# EAGLE schematic pdp8i-cpu (EAGLE 6.6.0), part 3 of 3
## Sheet 27 of 40
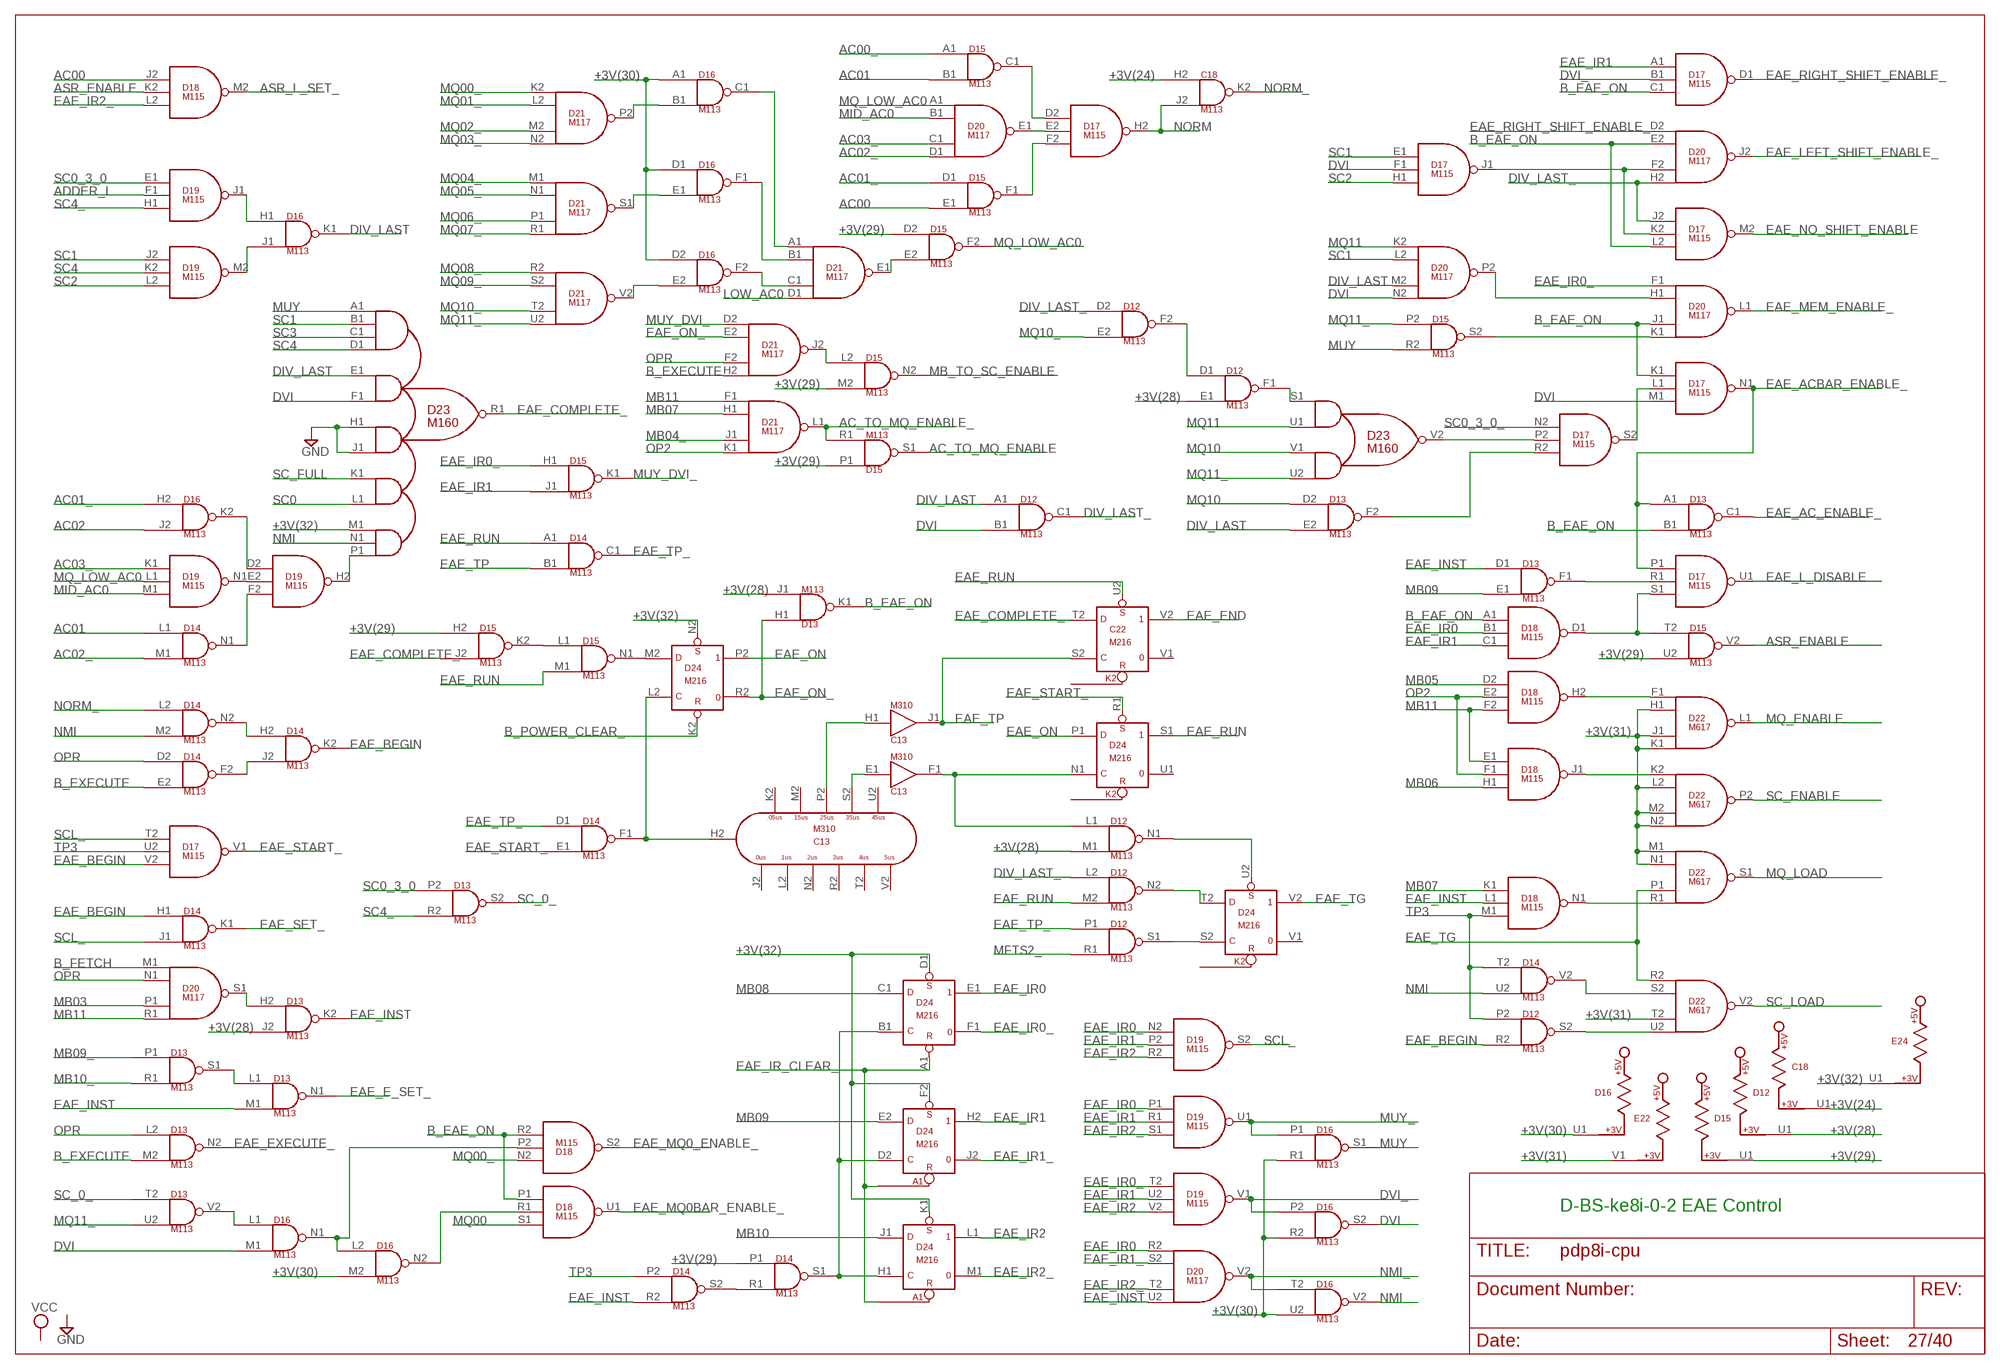
[diagram p27: schematic, sheet 27]

### Parts
C13  M310  [H807]
C18  M113  [H807]
C22  M216  [H807]
D12  M113  [H807]
D13  M113  [H807]
D14  M113  [H807]
D15  M113  [H807]
D16  M113  [H807]
D17  M115  [H807]
D18  M115  [H807]
D19  M115  [H807]
D20  M117  [H807]
D21  M117  [H807]
D22  M617  [H807]
D23  M160  [H807]
D24  M216  [H807]

### Nets
+3V(24): C18.H2(K2:IN1) C18.U1 ; also sheet 28
+3V(28): D12.E1(F1:IN2) D12.M1(N1:IN2) D12.U1 D13.J1(K1:IN2) D13.J2(K2:IN2) ; also sheet 28
+3V(29): D14.P1(S1:IN1) D15.D2(F2:IN1) D15.H2(K2:IN1) D15.M2(N2:IN2) D15.P1(S1:IN1) D15.U1 D15.U2(V2:IN2)
+3V(30): D16.A1(C1:IN1) D16.D1(F1:IN1) D16.D2(F2:IN1) D16.M2(N2:IN2) D16.R1(S1:IN2) D16.R2(S2:IN2) D16.U1 D16.U2(V2:IN2)
+3V(31): D22.H1(L1:IN2) D22.J1(L1:IN3) D22.K1(L1:IN4) D22.L2(P2:IN2) D22.M1(S1:IN1) D22.M2(P2:IN3) D22.N1(S1:IN2) D22.N2(P2:IN4) D22.T2(V2:IN3) E22.V1
+3V(32): D23.M1(R1:IN5A) D24.D1(E1:S) D24.F2(H2:S) D24.K1(L1:S) D24.N2(P2:S) E24.U1 ; also sheet 28
AC00: D15.E1(F1:IN2) D18.J2(M2:IN1) ; also sheet 7,9,14,28
AC00_: D15.A1(C1:IN1) ; also sheet 7,9
AC01: D14.L1(N1:IN1) D15.B1(C1:IN2) ; also sheet 9,14,28
AC01_: D15.D1(F1:IN1) D16.H2(K2:IN1) ; also sheet 7,9
AC02: D16.J2(K2:IN2) ; also sheet 9,14,28
AC02_: D14.M1(N1:IN2) D20.D1(E1:IN4) ; also sheet 7,9
AC03_: D19.K1(N1:IN1) D20.C1(E1:IN3) ; also sheet 7,9
AC_TO_MQ_ENABLE: D15.S1(S1:OUT) ; also sheet 28
AC_TO_MQ_ENABLE_: D15.R1(S1:IN2) D21.L1(L1:OUT) ; also sheet 5
ADDER_L: D19.F1(J1:IN2) ; also sheet 28
ASR_ENABLE: D15.V2(V2:OUT) D18.K2(M2:IN2) ; also sheet 9
ASR_L_SET_: D18.M2(M2:OUT) ; also sheet 9
B_EAE_ON: D13.B1(C1:IN2) D13.K1(K1:OUT) D17.C1(D1:IN3) D17.K1(N1:IN1) D17.L2(M2:IN3) D18.A1(D1:IN1) D18.P1(U1:IN1) D18.R2(S2:IN3) D20.E2(J2:IN2) D20.J1(L1:IN3) ; also sheet 9,28
B_EXECUTE: D13.M2(N2:IN2) D14.E2(F2:IN2) D21.H2(J2:IN4) ; also sheet 4,5,6,7
B_FETCH: D20.M1(S1:IN1) ; also sheet 2,4,5,6,7,8,22,29
B_POWER_CLEAR_: D24.K2(P2:R) ; also sheet 2,17
DIV_LAST: D12.A1(C1:IN1) D13.E2(F2:IN2) D16.K1(K1:OUT) D20.M2(P2:IN3) D23.E1(R1:IN2A)
DIV_LAST_: D12.C1(C1:OUT) D12.D2(F2:IN1) D12.L2(N2:IN1) D17.J2(M2:IN1) D20.H2(J2:IN4)
DVI: D12.B1(C1:IN2) D16.M1(N1:IN2) D16.S2(S2:OUT) D17.F1(J1:IN2) D17.M1(N1:IN3) D20.N2(P2:IN4) D23.F1(R1:IN2B)
DVI_: D16.P2(S2:IN1) D17.B1(D1:IN2) D19.V1(V1:OUT) ; also sheet 28
EAE_AC_ENABLE_: D13.C1(C1:OUT) ; also sheet 5
EAE_ACBAR_ENABLE_: D13.A1(C1:IN1) D17.N1(N1:OUT) D17.P1(U1:IN1) ; also sheet 5
EAE_BEGIN: D12.R2(S2:IN2) D14.H1(K1:IN1) D14.K2(K2:OUT) D17.V2(V1:IN3)
EAE_COMPLETE_: C22.T2(V2:D) D15.J2(K2:IN2) D23.R1(R1:OUT)
EAE_E_SET_: D13.N1(N1:OUT) ; also sheet 4,5
EAE_END: C22.V2 ; also sheet 2
EAE_EXECUTE_: D13.N2(N2:OUT) ; also sheet 6
EAE_INST: D13.D1(F1:IN1) D13.K2(K2:OUT) D13.M1(N1:IN2) D14.R2(S2:IN2) D18.L1(N1:IN2) D20.U2(V2:IN4)
EAE_IR0: D18.B1(D1:IN2) D20.R2(V2:IN1) D24.E1
EAE_IR0_: D15.H1(K1:IN1) D19.N2(S2:IN1) D19.P1(U1:IN1) D19.T2(V1:IN1) D20.F1(L1:IN1) D24.F1
EAE_IR1: D15.J1(K1:IN2) D17.A1(D1:IN1) D18.C1(D1:IN3) D19.R1(U1:IN2) D19.U2(V1:IN2) D24.H2
EAE_IR1_: D19.P2(S2:IN2) D20.S2(V2:IN2) D24.J2
EAE_IR2: D19.R2(S2:IN3) D19.V2(V1:IN3) D24.L1
EAE_IR2_: D18.L2(M2:IN3) D19.S1(U1:IN3) D20.T2(V2:IN3) D24.M1 ; also sheet 9
EAE_IR_CLEAR_: D24.A1(E1:R) ; also sheet 4
EAE_L_DISABLE: D17.U1(U1:OUT) ; also sheet 5
EAE_LEFT_SHIFT_ENABLE_: D20.J2(J2:OUT) ; also sheet 6
EAE_MEM_ENABLE_: D20.L1(L1:OUT) ; also sheet 5
EAE_MQ0_ENABLE_: D18.S2(S2:OUT) ; also sheet 13
EAE_MQ0BAR_ENABLE_: D18.U1(U1:OUT) ; also sheet 13
EAE_NO_SHIFT_ENABLE: D17.M2(M2:OUT) ; also sheet 6
EAE_ON: D24.P1(S1:D) D24.P2 ; also sheet 28
EAE_ON_: D13.H1(K1:IN1) D21.E2(J2:IN2) D24.R2 ; also sheet 9,13
EAE_RIGHT_SHIFT_ENABLE_: D17.D1(D1:OUT) D20.D2(J2:IN1) ; also sheet 6,28
EAE_RUN: C22.U2(V2:S) D12.M2(N2:IN2) D14.A1(C1:IN1) D15.M1(N1:IN2) D24.S1
EAE_SET_: D14.K1(K1:OUT) ; also sheet 2
EAE_START_: D14.E1(F1:IN2) D17.V1(V1:OUT) D24.R1(S1:S) ; also sheet 2
EAE_TG: D22.P1(S1:IN3) D22.R2(V2:IN1) D24.V2
EAE_TP: C13.J1(J1:OUT) C22.S2(V2:C) D14.B1(C1:IN2)
EAE_TP_: D12.P1(S1:IN1) D14.C1(C1:OUT) D14.D1(F1:IN1) ; also sheet 7,28
GND [Suppply]: D23.H1(R1:IN3A) D23.J1(R1:IN3B) ; also sheet 2,5,9,10,11,12,13,14,22,26,30
LOW_AC0: D21.D1(E1:IN4) ; also sheet 7
MB03: D20.P1(S1:IN3) ; also sheet 4,5,9,14,21,29,30
MB04_: D21.J1(L1:IN3) ; also sheet 5,8,9,14,29,30,32
MB05: D18.D2(H2:IN1) ; also sheet 5,7,9,14,21,30,32
MB06: D18.H1(J1:IN3) ; also sheet 5,7,9,14,21,22,30
MB07: D18.K1(N1:IN1) D21.H1(L1:IN2) ; also sheet 5,7,9,14,21,22,26,30
MB08: D24.C1(E1:D) ; also sheet 6,7,9,14,21,22,26,30
MB09: D13.E1(F1:IN2) D24.E2(H2:D) ; also sheet 2,5,6,9,14,21,22,29,30
MB09_: D13.P1(S1:IN1) ; also sheet 6,9,26,28,30
MB10: D24.J1(L1:D) ; also sheet 2,6,8,9,14,21,22,29,30
MB10_: D13.R1(S1:IN2) ; also sheet 6,8,9,22,26,28,30
MB11: D18.E1(J1:IN1) D18.F2(H2:IN3) D20.R1(S1:IN4) D21.F1(L1:IN1) ; also sheet 2,6,9,14,21,22,29,30
MB_TO_SC_ENABLE: D15.N2(N2:OUT) ; also sheet 28
MFTS2_: D12.R1(S1:IN2) ; also sheet 2
MID_AC0: D19.M1(N1:IN3) D20.B1(E1:IN2) ; also sheet 7
MQ00: D18.S1(U1:IN3) ; also sheet 10,28
MQ00_: D18.N2(S2:IN1) D21.K2(P2:IN1) ; also sheet 28
MQ01_: D21.L2(P2:IN2) ; also sheet 28
MQ02_: D21.M2(P2:IN3) ; also sheet 28
MQ03_: D21.N2(P2:IN4) ; also sheet 28
MQ04_: D21.M1(S1:IN1) ; also sheet 28
MQ05_: D21.N1(S1:IN2) ; also sheet 28
MQ06_: D21.P1(S1:IN3) ; also sheet 28
MQ07_: D21.R1(S1:IN4) ; also sheet 28
MQ08_: D21.R2(V2:IN1) ; also sheet 28
MQ09_: D21.S2(V2:IN2) ; also sheet 28
MQ10: D13.D2(F2:IN1) D23.V1(V2:IN2A) ; also sheet 13,28
MQ10_: D12.E2(F2:IN2) D21.T2(V2:IN3) ; also sheet 28
MQ11: D20.K2(P2:IN1) D23.U1(V2:IN1B) ; also sheet 13,28
MQ11_: D13.U2(V2:IN2) D15.P2(S2:IN1) D21.U2(V2:IN4) D23.U2(V2:IN2B) ; also sheet 28
MQ_ENABLE: D22.L1(L1:OUT) ; also sheet 10,11,12,13
MQ_LOAD: D22.S1(S1:OUT) ; also sheet 28
MQ_LOW_AC0: D15.F2(F2:OUT) D19.L1(N1:IN2) D20.A1(E1:IN1)
MUY: D15.R2(S2:IN2) D16.S1(S1:OUT) D23.A1(R1:IN1A)
MUY_: D16.P1(S1:IN1) D19.U1(U1:OUT)
MUY_DVI_: D15.K1(K1:OUT) D21.D2(J2:IN1)
N$404: D16.H1(K1:IN1) D19.J1(J1:OUT)
N$405: D16.J1(K1:IN2) D19.M2(M2:OUT)
N$406: D19.E2(H2:IN2) D19.N1(N1:OUT)
N$419: D16.K2(K2:OUT) D19.D2(H2:IN1)
N$568: D14.N1(N1:OUT) D19.F2(H2:IN3)
N$570: D19.H2(H2:OUT) D23.P1(R1:IN5C)
N$571: D16.B1(C1:IN2) D21.P2(P2:OUT)
N$572: D16.E1(F1:IN2) D21.S1(S1:OUT)
N$573: D16.E2(F2:IN2) D21.V2(V2:OUT)
N$574: D16.C1(C1:OUT) D21.A1(E1:IN1)
N$575: D16.F2(F2:OUT) D21.C1(E1:IN3)
N$576: D16.F1(F1:OUT) D21.B1(E1:IN2)
N$577: D15.E2(F2:IN2) D21.E1(E1:OUT)
N$578: D17.E2(H2:IN2) D20.E1(E1:OUT)
N$579: D15.C1(C1:OUT) D17.D2(H2:IN1)
N$580: D15.F1(F1:OUT) D17.F2(H2:IN3)
N$581: D15.L2(N2:IN1) D21.J2(J2:OUT)
N$582: D17.J1(J1:OUT) D17.K2(M2:IN2) D20.F2(J2:IN3)
N$583: D17.L1(N1:IN2) D17.S2(S2:OUT)
N$584: D15.S2(S2:OUT) D20.K1(L1:IN4)
N$585: D17.P2(S2:IN2) D23.V2(V2:OUT)
N$586: D20.H1(L1:IN2) D20.P2(P2:OUT)
N$587: D12.D1(F1:IN1) D12.F2(F2:OUT)
N$588: D13.F2(F2:OUT) D17.R2(S2:IN3)
N$589: D12.F1(F1:OUT) D23.S1(V2:IN1A)
N$590: D15.K2(K2:OUT) D15.L1(N1:IN1)
N$591: D13.F1(F1:OUT) D17.R1(U1:IN2)
N$592: D15.T2(V2:IN1) D17.S1(U1:IN3) D18.D1(D1:OUT)
N$593: D18.H2(H2:OUT) D22.F1(L1:IN1)
N$594: D18.N1(N1:OUT) D22.R1(S1:IN4)
N$595: D12.S2(S2:OUT) D22.U2(V2:IN4)
N$596: C13.E1(F1:IN) C13.S2(H2:S2)
N$597: C13.H1(J1:IN) C13.P2(H2:P2)
N$598: D18.J1(J1:OUT) D22.K2(P2:IN1)
N$599: D14.V2(V2:OUT) D22.S2(V2:IN2)
N$600: D14.S1(S1:OUT) D24.B1(E1:C) D24.D2(H2:C) D24.H1(L1:C)
N$601: D14.R1(S1:IN2) D14.S2(S2:OUT)
N$602: D14.F2(F2:OUT) D14.J2(K2:IN2)
N$603: D12.N2(N2:OUT) D24.T2(V2:D)
N$604: D12.N1(N1:OUT) D24.U2(V2:S)
N$605: D12.S1(S1:OUT) D24.S2(V2:C)
N$606: D14.H2(K2:IN1) D14.N2(N2:OUT)
N$607: C13.H2(H2:H2) D14.F1(F1:OUT) D24.L2(P2:C)
N$608: C13.F1(F1:OUT) D12.L1(N1:IN1) D24.N1(S1:C)
N$609: D15.N1(N1:OUT) D24.M2(P2:D)
N$683: D13.H2(K2:IN1) D20.S1(S1:OUT)
N$684: D13.L1(N1:IN1) D13.S1(S1:OUT)
N$685: D13.V2(V2:OUT) D16.L1(N1:IN1)
N$686: D16.L2(N2:IN1) D16.N1(N1:OUT) D18.P2(S2:IN2)
N$688: D16.N2(N2:OUT) D18.R1(U1:IN2)
NMI: D14.M2(N2:IN2) D14.U2(V2:IN2) D16.V2(V2:OUT) D23.N1(R1:IN5B)
NMI_: D16.T2(V2:IN1) D20.V2(V2:OUT)
NORM: C18.J2(K2:IN2) D17.H2(H2:OUT)
NORM_: C18.K2(K2:OUT) D14.L2(N2:IN1)
OP2: D18.E2(H2:IN2) D18.F1(J1:IN2) D21.K1(L1:IN4) ; also sheet 2,5,7,26
OPR: D13.L2(N2:IN1) D14.D2(F2:IN1) D20.N1(S1:IN2) D21.F2(J2:IN3) ; also sheet 4,5,6,7
SC0: D23.L1(R1:IN4B) ; also sheet 12,28
SC0_3_0: D13.P2(S2:IN1) D19.E1(J1:IN1) ; also sheet 28
SC0_3_0_: D17.N2(S2:IN1) ; also sheet 28
SC1: D17.E1(J1:IN1) D19.J2(M2:IN1) D20.L2(P2:IN2) D23.B1(R1:IN1B) ; also sheet 12,28
SC2: D17.H1(J1:IN3) D19.L2(M2:IN3) ; also sheet 13,28
SC3: D23.C1(R1:IN1C) ; also sheet 13,28
SC4: D19.K2(M2:IN2) D23.D1(R1:IN1D) ; also sheet 13,28
SC4_: D13.R2(S2:IN2) D19.H1(J1:IN3) ; also sheet 28
SC_0_: D13.S2(S2:OUT) D13.T2(V2:IN1)
SC_ENABLE: D22.P2(P2:OUT) ; also sheet 10,11,12,13
SC_FULL: D23.K1(R1:IN4A) ; also sheet 28
SC_LOAD: D22.V2(V2:OUT) ; also sheet 28
SCL_: D14.J1(K1:IN2) D17.T2(V1:IN1) D19.S2(S2:OUT)
TP3: D12.P2(S2:IN1) D14.P2(S2:IN1) D14.T2(V2:IN1) D17.U2(V1:IN2) D18.M1(N1:IN3) ; also sheet 2,7,21,22,26,29,30
Unconnected: C13.J2(H2:J2) C13.K2(H2:K2) C13.L2(H2:L2) C13.M2(H2:M2) C13.N2(H2:N2) C13.R2(H2:R2) C13.T2(H2:T2) C13.U2(H2:U2) C13.V2(H2:V2) C18.V1 C22.V1 D12.V1 D13.U1 D13.V1 D14.U1 D14.V1 D15.V1 D16.V1 D18.T2(V1:IN1) D18.U2(V1:IN2) D18.V1(V1:OUT) D18.V2(V1:IN3) D20.U1 D20.V1 D21.U1 D21.V1 D24.U1 D24.V1

### Notes on the sheet
- D-BS-ke8i-0-2 EAE Control

## Sheet 28 of 40
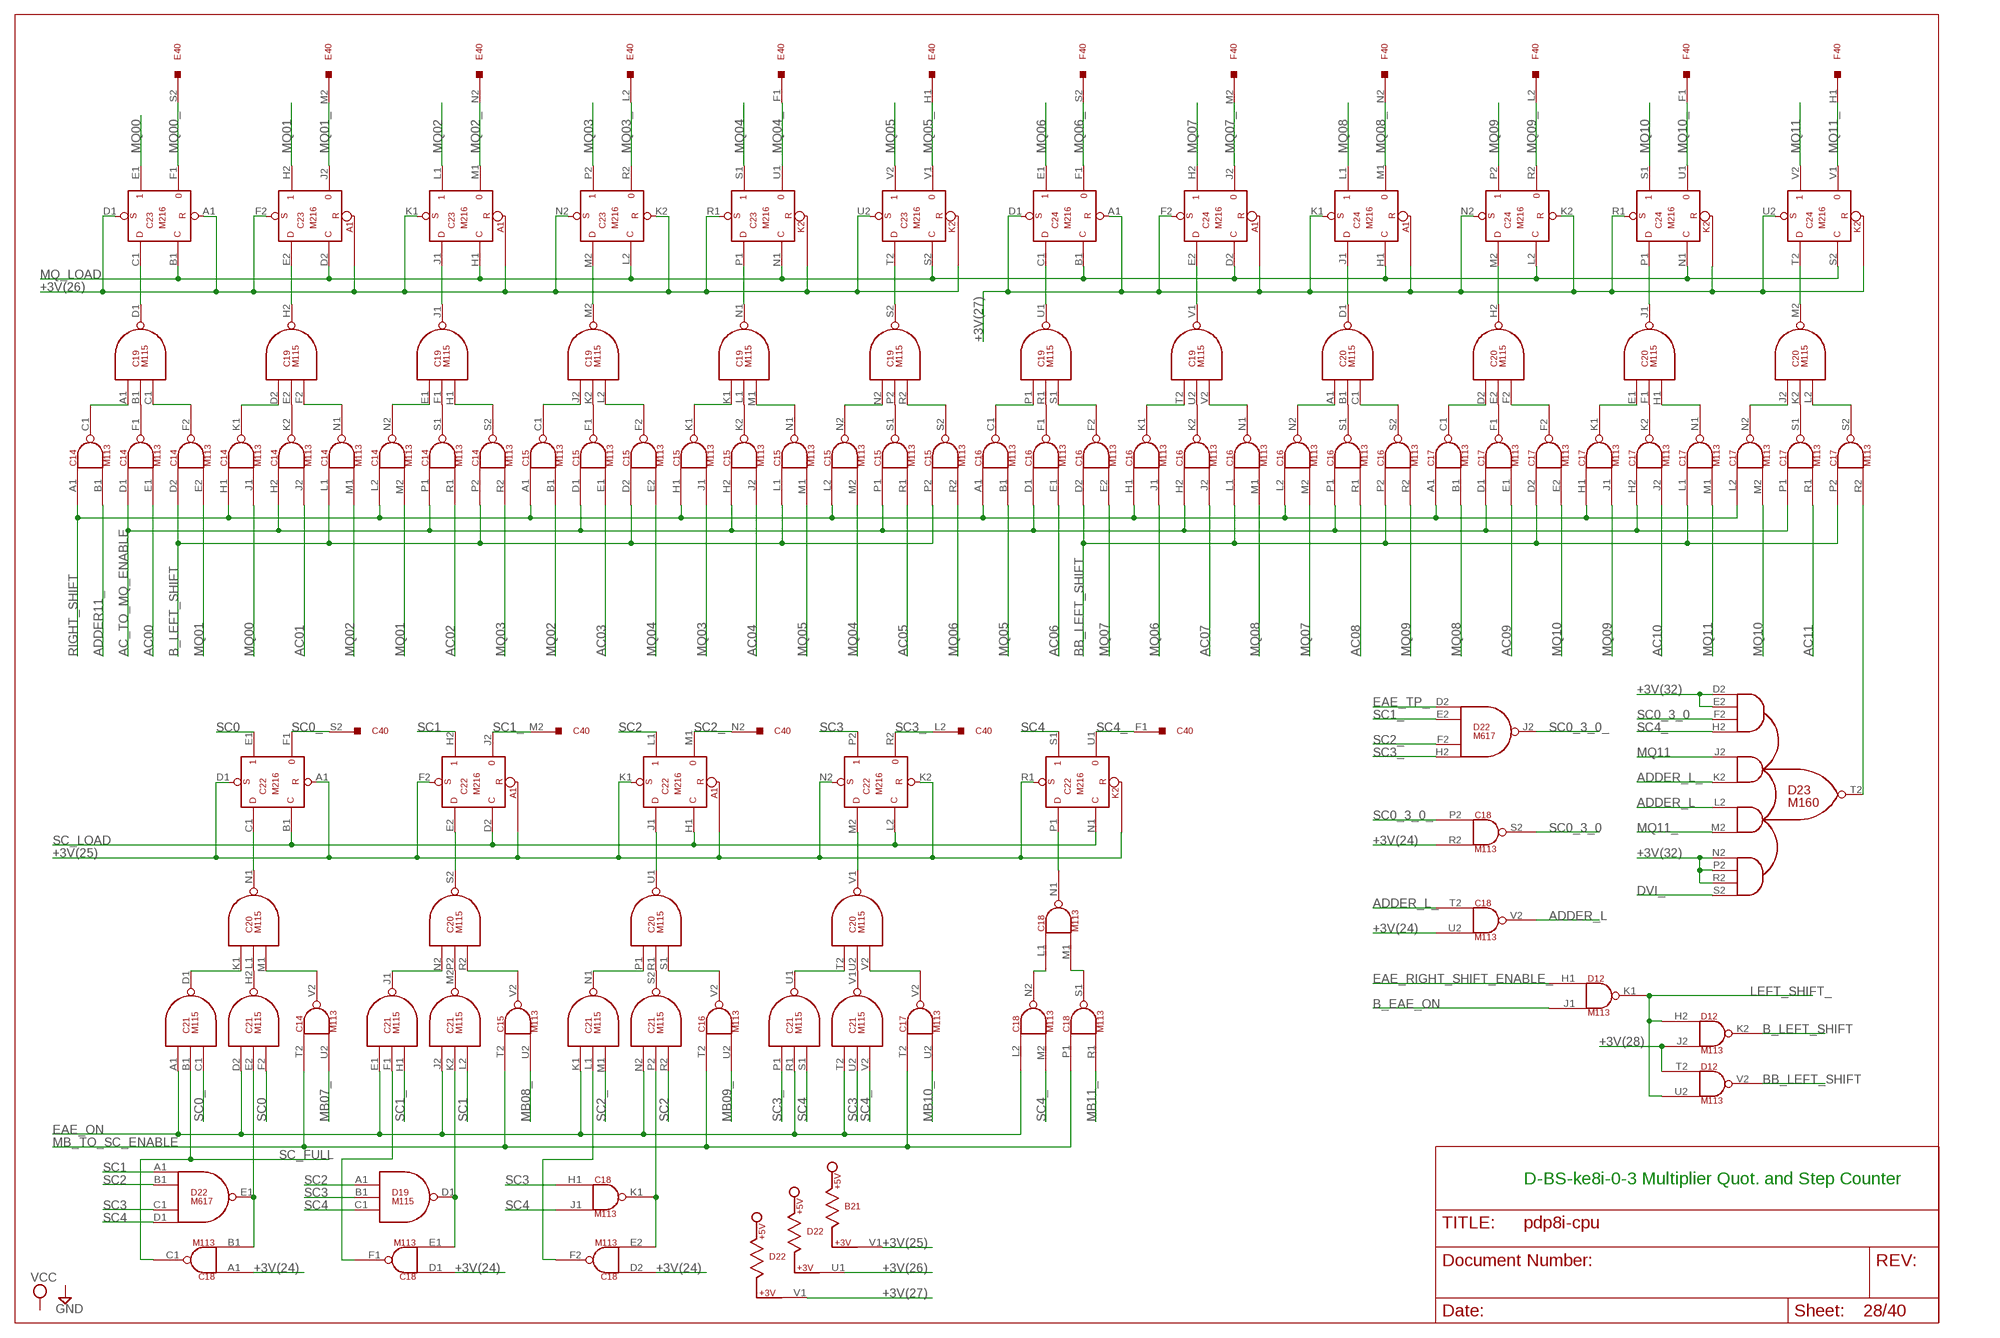
[diagram p28: schematic, sheet 28]

### Parts
C14  M113  [H807]
C15  M113  [H807]
C16  M113  [H807]
C17  M113  [H807]
C19  M115  [H807]
C20  M115  [H807]
C21  M115  [H807]
C23  M216  [H807]
C24  M216  [H807]

### Nets
+3V(24): C18.A1(C1:IN1) C18.D1(F1:IN1) C18.D2(F2:IN1) C18.R2(S2:IN2) C18.U2(V2:IN2) ; also sheet 27
+3V(25): B21.V1 C22.A1(E1:R) C22.D1(E1:S) C22.F2(H2:S) C22.K1(L1:S) C22.K2(P2:R) C22.N2(P2:S) C22.R1(S1:S)
+3V(26): C23.A1(E1:R) C23.D1(E1:S) C23.F2(H2:S) C23.K1(L1:S) C23.K2(P2:R) C23.N2(P2:S) C23.R1(S1:S) C23.U2(V2:S) D22.U1
+3V(27): C24.A1(E1:R) C24.D1(E1:S) C24.F2(H2:S) C24.K1(L1:S) C24.K2(P2:R) C24.N2(P2:S) C24.R1(S1:S) C24.U2(V2:S) D22.V1
+3V(28): D12.J2(K2:IN2) D12.T2(V2:IN1) ; also sheet 27
+3V(32): D23.D2(T2:IN1A) D23.E2(T2:IN1B) D23.N2(T2:IN4A) D23.P2(T2:IN4B) D23.R2(T2:IN4C) ; also sheet 27
AC00: C14.E1(F1:IN2) ; also sheet 7,9,14,27
AC01: C14.J2(K2:IN2) ; also sheet 9,14,27
AC02: C14.R1(S1:IN2) ; also sheet 9,14,27
AC03: C15.E1(F1:IN2) ; also sheet 9,14
AC04: C15.J2(K2:IN2) ; also sheet 9,14
AC05: C15.R1(S1:IN2) ; also sheet 9,14
AC06: C16.E1(F1:IN2) ; also sheet 9,14
AC07: C16.J2(K2:IN2) ; also sheet 9,14
AC08: C16.R1(S1:IN2) ; also sheet 9,14
AC09: C17.E1(F1:IN2) ; also sheet 9,14
AC10: C17.J2(K2:IN2) ; also sheet 9,14
AC11: C17.R1(S1:IN2) ; also sheet 9,14
AC_TO_MQ_ENABLE: C14.D1(F1:IN1) C14.H2(K2:IN1) C14.P1(S1:IN1) C15.D1(F1:IN1) C15.H2(K2:IN1) C15.P1(S1:IN1) C16.D1(F1:IN1) C16.H2(K2:IN1) C16.P1(S1:IN1) C17.D1(F1:IN1) C17.H2(K2:IN1) C17.P1(S1:IN1) ; also sheet 27
ADDER11_: C14.B1(C1:IN2) ; also sheet 9
ADDER_L: C18.V2(V2:OUT) D23.L2(T2:IN3A) ; also sheet 27
ADDER_L_: C18.T2(V2:IN1) D23.K2(T2:IN2B) ; also sheet 9,10,13
B_EAE_ON: D12.J1(K1:IN2) ; also sheet 9,27
B_LEFT_SHIFT: C14.D2(F2:IN1) C14.L1(N1:IN1) C14.P2(S2:IN1) C15.D2(F2:IN1) C15.L1(N1:IN1) C15.P2(S2:IN1) D12.K2(K2:OUT)
BB_LEFT_SHIFT: C16.D2(F2:IN1) C16.L1(N1:IN1) C16.P2(S2:IN1) C17.D2(F2:IN1) C17.L1(N1:IN1) C17.P2(S2:IN1) D12.V2(V2:OUT)
DVI_: D23.S2(T2:IN4D) ; also sheet 27
EAE_ON: C18.L2(N2:IN1) C21.A1(D1:IN1) C21.D2(H2:IN1) C21.E1(J1:IN1) C21.J2(M2:IN1) C21.K1(N1:IN1) C21.N2(S2:IN1) C21.R1(U1:IN2) C21.T2(V1:IN1) ; also sheet 27
EAE_RIGHT_SHIFT_ENABLE_: D12.H1(K1:IN1) ; also sheet 6,27
EAE_TP_: D22.D2(J2:IN1) ; also sheet 7,27
LEFT_SHIFT_: D12.H2(K2:IN1) D12.K1(K1:OUT) D12.U2(V2:IN2)
MB07_: C14.U2(V2:IN2) ; also sheet 5,8,9,14,22,26,29,30,32
MB08_: C15.U2(V2:IN2) ; also sheet 6,7,8,9,14,22,26,29,30,32
MB09_: C16.U2(V2:IN2) ; also sheet 6,9,26,27,30
MB10_: C17.U2(V2:IN2) ; also sheet 6,8,9,22,26,27,30
MB11_: C18.R1(S1:IN2) ; also sheet 2,5,7,8,9,22,26,29,30
MB_TO_SC_ENABLE: C14.T2(V2:IN1) C15.T2(V2:IN1) C16.T2(V2:IN1) C17.T2(V2:IN1) C18.P1(S1:IN1) ; also sheet 27
MQ00: C14.J1(K1:IN2) C23.E1 ; also sheet 10,27
MQ00_: C23.F1 E40.S2 ; also sheet 27
MQ01: C14.E2(F2:IN2) C14.M2(N2:IN2) C23.H2 ; also sheet 10
MQ01_: C23.J2 E40.M2 ; also sheet 27
MQ02: C14.M1(N1:IN2) C15.B1(C1:IN2) C23.L1 ; also sheet 10
MQ02_: C23.M1 E40.N2 ; also sheet 27
MQ03: C14.R2(S2:IN2) C15.J1(K1:IN2) C23.P2 ; also sheet 11
MQ03_: C23.R2 E40.L2 ; also sheet 27
MQ04: C15.E2(F2:IN2) C15.M2(N2:IN2) C23.S1 ; also sheet 11
MQ04_: C23.U1 E40.F1 ; also sheet 27
MQ05: C15.M1(N1:IN2) C16.B1(C1:IN2) C23.V2 ; also sheet 11
MQ05_: C23.V1 E40.H1 ; also sheet 27
MQ06: C15.R2(S2:IN2) C16.J1(K1:IN2) C24.E1 ; also sheet 12
MQ06_: C24.F1 F40.S2 ; also sheet 27
MQ07: C16.E2(F2:IN2) C16.M2(N2:IN2) C24.H2 ; also sheet 12
MQ07_: C24.J2 F40.M2 ; also sheet 27
MQ08: C16.M1(N1:IN2) C17.B1(C1:IN2) C24.L1 ; also sheet 12
MQ08_: C24.M1 F40.N2 ; also sheet 27
MQ09: C16.R2(S2:IN2) C17.J1(K1:IN2) C24.P2 ; also sheet 13
MQ09_: C24.R2 F40.L2 ; also sheet 27
MQ10: C17.E2(F2:IN2) C17.M2(N2:IN2) C24.S1 ; also sheet 13,27
MQ10_: C24.U1 F40.F1 ; also sheet 27
MQ11: C17.M1(N1:IN2) C24.V2 D23.J2(T2:IN2A) ; also sheet 13,27
MQ11_: C24.V1 D23.M2(T2:IN3B) F40.H1 ; also sheet 27
MQ_LOAD: C23.B1(E1:C) C23.D2(H2:C) C23.H1(L1:C) C23.L2(P2:C) C23.N1(S1:C) C23.S2(V2:C) C24.B1(E1:C) C24.D2(H2:C) C24.H1(L1:C) C24.L2(P2:C) C24.N1(S1:C) C24.S2(V2:C) ; also sheet 27
N$610: C14.F1(F1:OUT) C19.B1(D1:IN2)
N$611: C14.K2(K2:OUT) C19.E2(H2:IN2)
N$612: C14.S1(S1:OUT) C19.F1(J1:IN2)
N$613: C15.F1(F1:OUT) C19.K2(M2:IN2)
N$614: C15.K2(K2:OUT) C19.L1(N1:IN2)
N$615: C15.S1(S1:OUT) C19.P2(S2:IN2)
N$616: C16.F1(F1:OUT) C19.R1(U1:IN2)
N$617: C16.K2(K2:OUT) C19.U2(V1:IN2)
N$618: C16.S1(S1:OUT) C20.B1(D1:IN2)
N$619: C17.F1(F1:OUT) C20.E2(H2:IN2)
N$620: C17.K2(K2:OUT) C20.F1(J1:IN2)
N$621: C17.S1(S1:OUT) C20.K2(M2:IN2)
N$622: C14.C1(C1:OUT) C19.A1(D1:IN1)
N$623: C14.F2(F2:OUT) C19.C1(D1:IN3)
N$624: C14.K1(K1:OUT) C19.D2(H2:IN1)
N$625: C14.N1(N1:OUT) C19.F2(H2:IN3)
N$626: C14.N2(N2:OUT) C19.E1(J1:IN1)
N$627: C14.S2(S2:OUT) C19.H1(J1:IN3)
N$628: C15.C1(C1:OUT) C19.J2(M2:IN1)
N$629: C15.F2(F2:OUT) C19.L2(M2:IN3)
N$630: C15.K1(K1:OUT) C19.K1(N1:IN1)
N$631: C15.N1(N1:OUT) C19.M1(N1:IN3)
N$632: C15.N2(N2:OUT) C19.N2(S2:IN1)
N$633: C15.S2(S2:OUT) C19.R2(S2:IN3)
N$634: C16.C1(C1:OUT) C19.P1(U1:IN1)
N$635: C16.F2(F2:OUT) C19.S1(U1:IN3)
N$636: C16.K1(K1:OUT) C19.T2(V1:IN1)
N$637: C16.N1(N1:OUT) C19.V2(V1:IN3)
N$638: C16.N2(N2:OUT) C20.A1(D1:IN1)
N$639: C16.S2(S2:OUT) C20.C1(D1:IN3)
N$640: C17.C1(C1:OUT) C20.D2(H2:IN1)
N$641: C17.F2(F2:OUT) C20.F2(H2:IN3)
N$642: C17.K1(K1:OUT) C20.E1(J1:IN1)
N$643: C17.N1(N1:OUT) C20.H1(J1:IN3)
N$644: C17.N2(N2:OUT) C20.J2(M2:IN1)
N$645: C17.S2(S2:OUT) C20.L2(M2:IN3)
N$646: C19.D1(D1:OUT) C23.C1(E1:D)
N$647: C19.H2(H2:OUT) C23.E2(H2:D)
N$648: C19.J1(J1:OUT) C23.J1(L1:D)
N$649: C19.M2(M2:OUT) C23.M2(P2:D)
N$650: C19.N1(N1:OUT) C23.P1(S1:D)
N$651: C19.S2(S2:OUT) C23.T2(V2:D)
N$652: C19.U1(U1:OUT) C24.C1(E1:D)
N$653: C19.V1(V1:OUT) C24.E2(H2:D)
N$654: C20.D1(D1:OUT) C24.J1(L1:D)
N$655: C20.H2(H2:OUT) C24.M2(P2:D)
N$656: C20.J1(J1:OUT) C24.P1(S1:D)
N$657: C20.M2(M2:OUT) C24.T2(V2:D)
N$658: C20.L1(N1:IN2) C21.H2(H2:OUT)
N$659: C20.K1(N1:IN1) C21.D1(D1:OUT)
N$660: C14.V2(V2:OUT) C20.M1(N1:IN3)
N$661: C20.N1(N1:OUT) C22.C1(E1:D)
N$662: C18.L1(N1:IN1) C18.N2(N2:OUT)
N$663: C18.M1(N1:IN2) C18.S1(S1:OUT)
N$664: C20.S2(S2:OUT) C22.E2(H2:D)
N$665: C20.U1(U1:OUT) C22.J1(L1:D)
N$666: C20.V1(V1:OUT) C22.M2(P2:D)
N$667: C18.N1(N1:OUT) C22.P1(S1:D)
N$668: C20.N2(S2:IN1) C21.J1(J1:OUT)
N$669: C20.P1(U1:IN1) C21.N1(N1:OUT)
N$670: C20.T2(V1:IN1) C21.U1(U1:OUT)
N$671: C20.P2(S2:IN2) C21.M2(M2:OUT)
N$672: C20.R1(U1:IN2) C21.S2(S2:OUT)
N$673: C20.U2(V1:IN2) C21.V1(V1:OUT)
N$674: C15.V2(V2:OUT) C20.R2(S2:IN3)
N$675: C16.V2(V2:OUT) C20.S1(U1:IN3)
N$676: C17.V2(V2:OUT) C20.V2(V1:IN3)
N$677: C18.B1(C1:IN2) C21.E2(H2:IN2) D22.E1(E1:OUT)
N$678: C18.E1(F1:IN2) C21.K2(M2:IN2) D19.D1(D1:OUT)
N$679: C18.F1(F1:OUT) C21.F1(J1:IN2)
N$680: C18.E2(F2:IN2) C18.K1(K1:OUT) C21.P2(S2:IN2)
N$681: C18.F2(F2:OUT) C21.L1(N1:IN2)
N$682: C17.R2(S2:IN2) D23.T2(T2:OUT)
RIGHT_SHIFT: C14.A1(C1:IN1) C14.H1(K1:IN1) C14.L2(N2:IN1) C15.A1(C1:IN1) C15.H1(K1:IN1) C15.L2(N2:IN1) C16.A1(C1:IN1) C16.H1(K1:IN1) C16.L2(N2:IN1) C17.A1(C1:IN1) C17.H1(K1:IN1) C17.L2(N2:IN1) ; also sheet 6,9,10,11,12,13
SC0: C21.F2(H2:IN3) C22.E1 ; also sheet 12,27
SC0_: C21.C1(D1:IN3) C22.F1 C40.S2
SC0_3_0: C18.S2(S2:OUT) D23.F2(T2:IN1C) ; also sheet 27
SC0_3_0_: C18.P2(S2:IN1) D22.J2(J2:OUT) ; also sheet 27
SC1: C21.L2(M2:IN3) C22.H2 D22.A1(E1:IN1) ; also sheet 12,27
SC1_: C21.H1(J1:IN3) C22.J2 C40.M2 D22.E2(J2:IN2)
SC2: C21.R2(S2:IN3) C22.L1 D19.A1(D1:IN1) D22.B1(E1:IN2) ; also sheet 13,27
SC2_: C21.M1(N1:IN3) C22.M1 C40.N2 D22.F2(J2:IN3)
SC3: C18.H1(K1:IN1) C21.U2(V1:IN2) C22.P2 D19.B1(D1:IN2) D22.C1(E1:IN3) ; also sheet 13,27
SC3_: C21.P1(U1:IN1) C22.R2 C40.L2 D22.H2(J2:IN4)
SC4: C18.J1(K1:IN2) C21.S1(U1:IN3) C22.S1 D19.C1(D1:IN3) D22.D1(E1:IN4) ; also sheet 13,27
SC4_: C18.M2(N2:IN2) C21.V2(V1:IN3) C22.U1 C40.F1 D23.H2(T2:IN1D) ; also sheet 27
SC_FULL: C18.C1(C1:OUT) C21.B1(D1:IN2) ; also sheet 27
SC_LOAD: C22.B1(E1:C) C22.D2(H2:C) C22.H1(L1:C) C22.L2(P2:C) C22.N1(S1:C) ; also sheet 27
Unconnected: C14.U1 C14.V1 C15.U1 C15.V1 C16.U1 C16.V1 C17.U1 C17.V1

### Notes on the sheet
- D-BS-ke8i-0-3 Multiplier Quot. and Step Counter

## Sheet 29 of 40
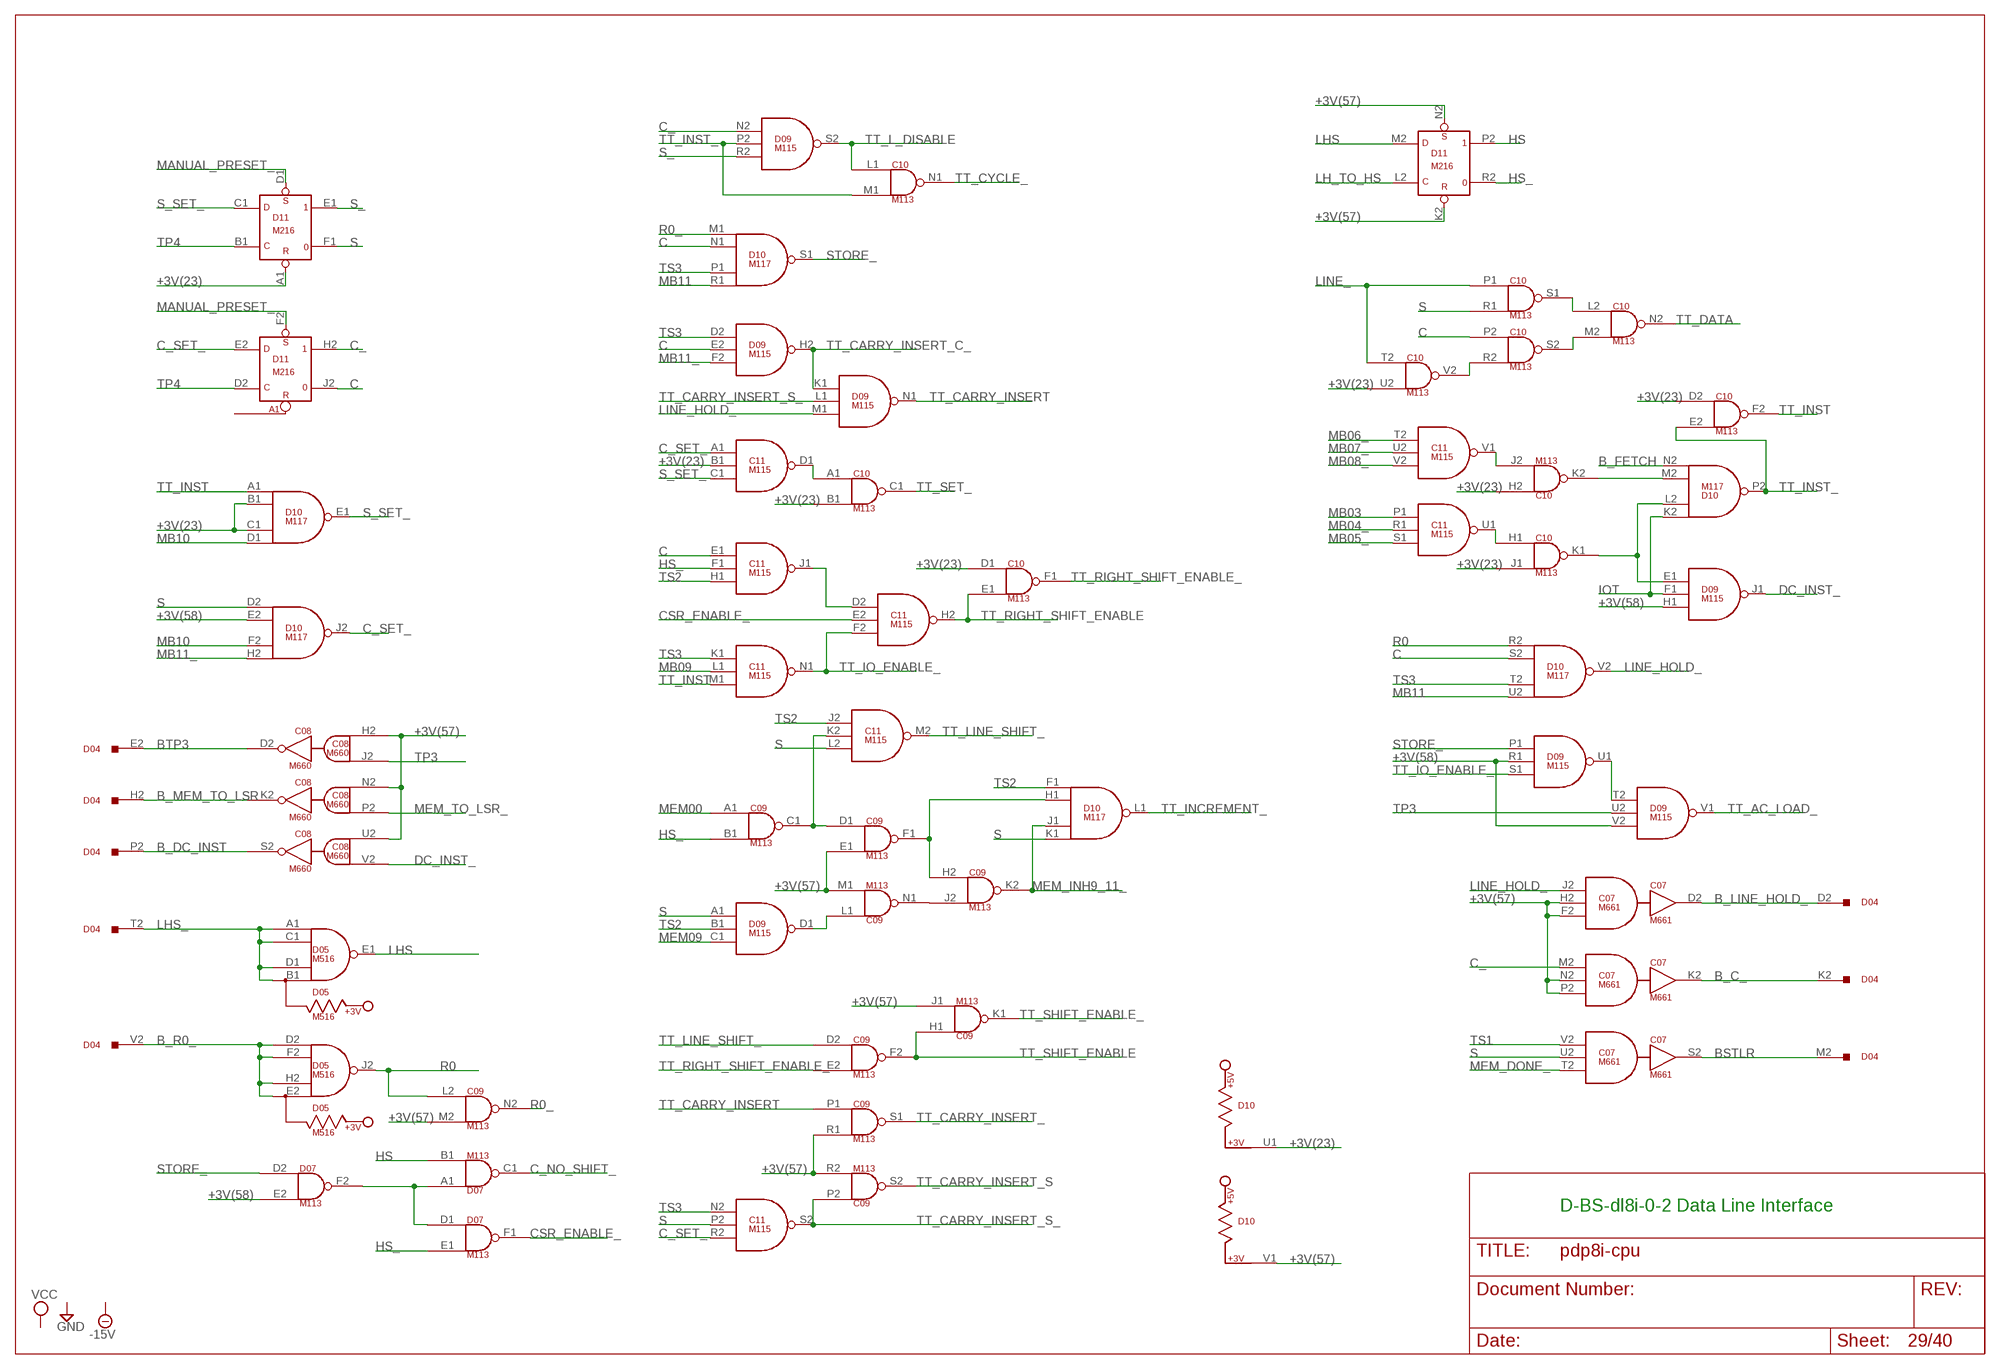
[diagram p29: schematic, sheet 29]

### Parts
C07  M661  [H807]
C08  M660  [H807]
C09  M113  [H807]
C10  M113  [H807]
C11  M115  [H807]
D04  W011  [H807]
D05  M516  [H807]
D09  M115  [H807]
D10  M117  [H807]
D11  M216  [H807]

### Nets
+3V(23): C10.B1(C1:IN2) C10.D1(F1:IN1) C10.D2(F2:IN1) C10.H2(K2:IN1) C10.J1(K1:IN2) C10.U2(V2:IN2) C11.B1(D1:IN2) D10.B1(E1:IN2) D10.C1(E1:IN3) D10.U1 D11.A1(E1:R)
+3V(57): C07.F2(D:IN3) C07.H2(D:IN2) C07.N2(K:IN2) C07.P2(K:IN3) C08.H2(D:IN1) C08.N2(K:IN1) C08.U2(S:IN1) C09.E1(F1:IN2) C09.J1(K1:IN2) C09.M1(N1:IN2) C09.M2(N2:IN2) C09.R1(S1:IN2) C09.R2(S2:IN2) D10.V1 D11.K2(P2:R) D11.N2(P2:S)
+3V(58): D07.E2(F2:IN2) D09.H1(J1:IN3) D09.R1(U1:IN2) D09.V2(V1:IN3) D10.E2(J2:IN2) ; also sheet 3
B_C_: C07.K2(K:OUT) D04.K2
B_DC_INST: C08.S2(S:OUT) D04.P2
B_FETCH: D10.N2(P2:IN4) ; also sheet 2,4,5,6,7,8,22,27
B_LINE_HOLD_: C07.D2(D:OUT) D04.D2
B_MEM_TO_LSR: C08.K2(K:OUT) D04.H2
B_R0_: D04.V2 D05.D2(J2:IN) D05.E2(J2:IN2) D05.F2(J2:IN3) D05.H2(J2:IN4)
BSTLR: C07.S2(S:OUT) D04.M2
BTP3: C08.D2(D:OUT) D04.E2
C: C10.P2(S2:IN1) C11.E1(J1:IN1) D09.E2(H2:IN2) D10.N1(S1:IN2) D10.S2(V2:IN2) D11.J2
C_: C07.M2(K:IN1) D09.N2(S2:IN1) D11.H2
C_NO_SHIFT_: D07.C1(C1:OUT) ; also sheet 6
C_SET_: C11.A1(D1:IN1) C11.R2(S2:IN3) D10.J2(J2:OUT) D11.E2(H2:D)
CSR_ENABLE_: C11.E2(H2:IN2) D07.F1(F1:OUT)
DC_INST_: C08.V2(S:IN2) D09.J1(J1:OUT)
HS: D07.B1(C1:IN2) D11.P2
HS_: C09.B1(C1:IN2) C11.F1(J1:IN2) D07.E1(F1:IN2) D11.R2
IOT: D09.F1(J1:IN2) D10.K2(P2:IN1) ; also sheet 2,4,7,8,22
LH_TO_HS: D11.L2(P2:C) ; also sheet 3
LHS: D05.E1(E1:OUT) D11.M2(P2:D)
LHS_: D04.T2 D05.A1(E1:IN) D05.B1(E1:IN2) D05.C1(E1:IN3) D05.D1(E1:IN4)
LINE_: C10.P1(S1:IN1) C10.T2(V2:IN1) ; also sheet 14
LINE_HOLD_: C07.J2(D:IN1) D09.M1(N1:IN3) D10.V2(V2:OUT)
MANUAL_PRESET_: D11.D1(E1:S) D11.F2(H2:S) ; also sheet 2,4,8,21
MB03: C11.P1(U1:IN1) ; also sheet 4,5,9,14,21,27,30
MB04_: C11.R1(U1:IN2) ; also sheet 5,8,9,14,27,30,32
MB05_: C11.S1(U1:IN3) ; also sheet 5,8,9,14,22,30
MB06_: C11.T2(V1:IN1) ; also sheet 5,8,9,14,22,30,32
MB07_: C11.U2(V1:IN2) ; also sheet 5,8,9,14,22,26,28,30,32
MB08_: C11.V2(V1:IN3) ; also sheet 6,7,8,9,14,22,26,28,30,32
MB09: C11.L1(N1:IN2) ; also sheet 2,5,6,9,14,21,22,27,30
MB10: D10.D1(E1:IN4) D10.F2(J2:IN3) ; also sheet 2,6,8,9,14,21,22,27,30
MB11: D10.R1(S1:IN4) D10.U2(V2:IN4) ; also sheet 2,6,9,14,21,22,27,30
MB11_: D09.F2(H2:IN3) D10.H2(J2:IN4) ; also sheet 2,5,7,8,9,22,26,28,30
MEM00: C09.A1(C1:IN1) ; also sheet 4,10,18,31
MEM09: D09.C1(D1:IN3) ; also sheet 13,18,31
MEM_DONE_: C07.T2(S:IN3) ; also sheet 2,8,21
MEM_INH9_11_: C09.K2(K2:OUT) D10.J1(L1:IN3) ; also sheet 5
MEM_TO_LSR_: C08.P2(K:IN2) ; also sheet 3
N$725: D07.A1(C1:IN1) D07.D1(F1:IN1) D07.F2(F2:OUT)
N$726: C09.L1(N1:IN1) D09.D1(D1:OUT)
N$727: C09.J2(K2:IN2) C09.N1(N1:OUT)
N$728: C09.C1(C1:OUT) C09.D1(F1:IN1) C11.K2(M2:IN2)
N$729: C09.F1(F1:OUT) C09.H2(K2:IN1) D10.H1(L1:IN2)
N$730: C11.D2(H2:IN1) C11.J1(J1:OUT)
N$731: C10.A1(C1:IN1) C11.D1(D1:OUT)
N$732: D09.T2(V1:IN1) D09.U1(U1:OUT)
N$733: C10.K1(K1:OUT) D09.E1(J1:IN1) D10.L2(P2:IN2)
N$742: C10.H1(K1:IN1) C11.U1(U1:OUT)
N$743: C10.J2(K2:IN2) C11.V1(V1:OUT)
N$744: C10.K2(K2:OUT) D10.M2(P2:IN3)
N$745: C10.R2(S2:IN2) C10.V2(V2:OUT)
N$746: C10.L2(N2:IN1) C10.S1(S1:OUT)
N$747: C10.M2(N2:IN2) C10.S2(S2:OUT)
R0: C09.L2(N2:IN1) D05.J2(J2:OUT) D10.R2(V2:IN1)
R0_: C09.N2(N2:OUT) D10.M1(S1:IN1)
S: C07.U2(S:IN2) C10.R1(S1:IN2) C11.L2(M2:IN3) C11.P2(S2:IN2) D09.A1(D1:IN1) D10.D2(J2:IN1) D10.K1(L1:IN4) D11.F1 ; also sheet 3
S_: D09.R2(S2:IN3) D11.E1 ; also sheet 3
S_SET_: C11.C1(D1:IN3) D10.E1(E1:OUT) D11.C1(E1:D)
STORE_: D07.D2(F2:IN1) D09.P1(U1:IN1) D10.S1(S1:OUT) ; also sheet 5
TP3: C08.J2(D:IN2) D09.U2(V1:IN2) ; also sheet 2,7,21,22,26,27,30
TP4: D11.B1(E1:C) D11.D2(H2:C) ; also sheet 2,4,7,8
TS1: C07.V2(S:IN1) ; also sheet 2,5,6
TS2: C11.H1(J1:IN3) C11.J2(M2:IN1) D09.B1(D1:IN2) D10.F1(L1:IN1) ; also sheet 2,5,6,7
TS3: C11.K1(N1:IN1) C11.N2(S2:IN1) D09.D2(H2:IN1) D10.P1(S1:IN3) D10.T2(V2:IN3) ; also sheet 2,5,6,22
TT_AC_LOAD_: D09.V1(V1:OUT) ; also sheet 7
TT_CARRY_INSERT: C09.P1(S1:IN1) D09.N1(N1:OUT) ; also sheet 7
TT_CARRY_INSERT_: C09.S1(S1:OUT) ; also sheet 5,6
TT_CARRY_INSERT_C_: D09.H2(H2:OUT) D09.K1(N1:IN1)
TT_CARRY_INSERT_S: C09.S2(S2:OUT) ; also sheet 13
TT_CARRY_INSERT_S_: C09.P2(S2:IN1) C11.S2(S2:OUT) D09.L1(N1:IN2)
TT_CYCLE_: C10.N1(N1:OUT) ; also sheet 6
TT_DATA: C10.N2(N2:OUT) ; also sheet 9
TT_INCREMENT_: D10.L1(L1:OUT) ; also sheet 6
TT_INST: C10.F2(F2:OUT) C11.M1(N1:IN3) D10.A1(E1:IN1)
TT_INST_: C10.E2(F2:IN2) C10.M1(N1:IN2) D09.P2(S2:IN2) D10.P2(P2:OUT) ; also sheet 2,9,14
TT_IO_ENABLE_: C11.F2(H2:IN3) C11.N1(N1:OUT) D09.S1(U1:IN3) ; also sheet 5
TT_L_DISABLE: C10.L1(N1:IN1) D09.S2(S2:OUT) ; also sheet 5
TT_LINE_SHIFT_: C09.D2(F2:IN1) C11.M2(M2:OUT) ; also sheet 10,11,12,13
TT_RIGHT_SHIFT_ENABLE: C10.E1(F1:IN2) C11.H2(H2:OUT)
TT_RIGHT_SHIFT_ENABLE_: C09.E2(F2:IN2) C10.F1(F1:OUT) ; also sheet 6
TT_SET_: C10.C1(C1:OUT) ; also sheet 4,5
TT_SHIFT_ENABLE: C09.F2(F2:OUT) C09.H1(K1:IN1) ; also sheet 9
TT_SHIFT_ENABLE_: C09.K1(K1:OUT) ; also sheet 6
Unconnected: C09.T2(V2:IN1) C09.U1 C09.U2(V2:IN2) C09.V1 C09.V2(V2:OUT) C10.U1 C10.V1 D04.S2 D05.F1(L1:IN) D05.H1(L1:IN2) D05.J1(L1:IN3) D05.K1(L1:IN4) D05.K2(P2:IN) D05.L1(L1:OUT) D05.L2(P2:IN2) D05.M1(S1:IN) D05.M2(P2:IN3) D05.N1(S1:IN2) D05.N2(P2:IN4) D05.P1(S1:IN3) D05.P2(P2:OUT) D05.R1(S1:IN4) D05.R2(V2:IN) D05.S1(S1:OUT) D05.S2(V2:IN2) D05.T2(V2:IN3) D05.U2(V2:IN4) D05.V2(V2:OUT) D09.J2(M2:IN1) D09.K2(M2:IN2) D09.L2(M2:IN3) D09.M2(M2:OUT) D11.H1(L1:C) D11.J1(L1:D) D11.K1(L1:S) D11.L1 D11.M1 D11.N1(S1:C) D11.P1(S1:D) D11.R1(S1:S) D11.S1 D11.S2(V2:C) D11.T2(V2:D) D11.U1 D11.U2(V2:S) D11.V1 D11.V2

### Notes on the sheet
- D-BS-dl8i-0-2 Data Line Interface

## Sheet 30 of 40
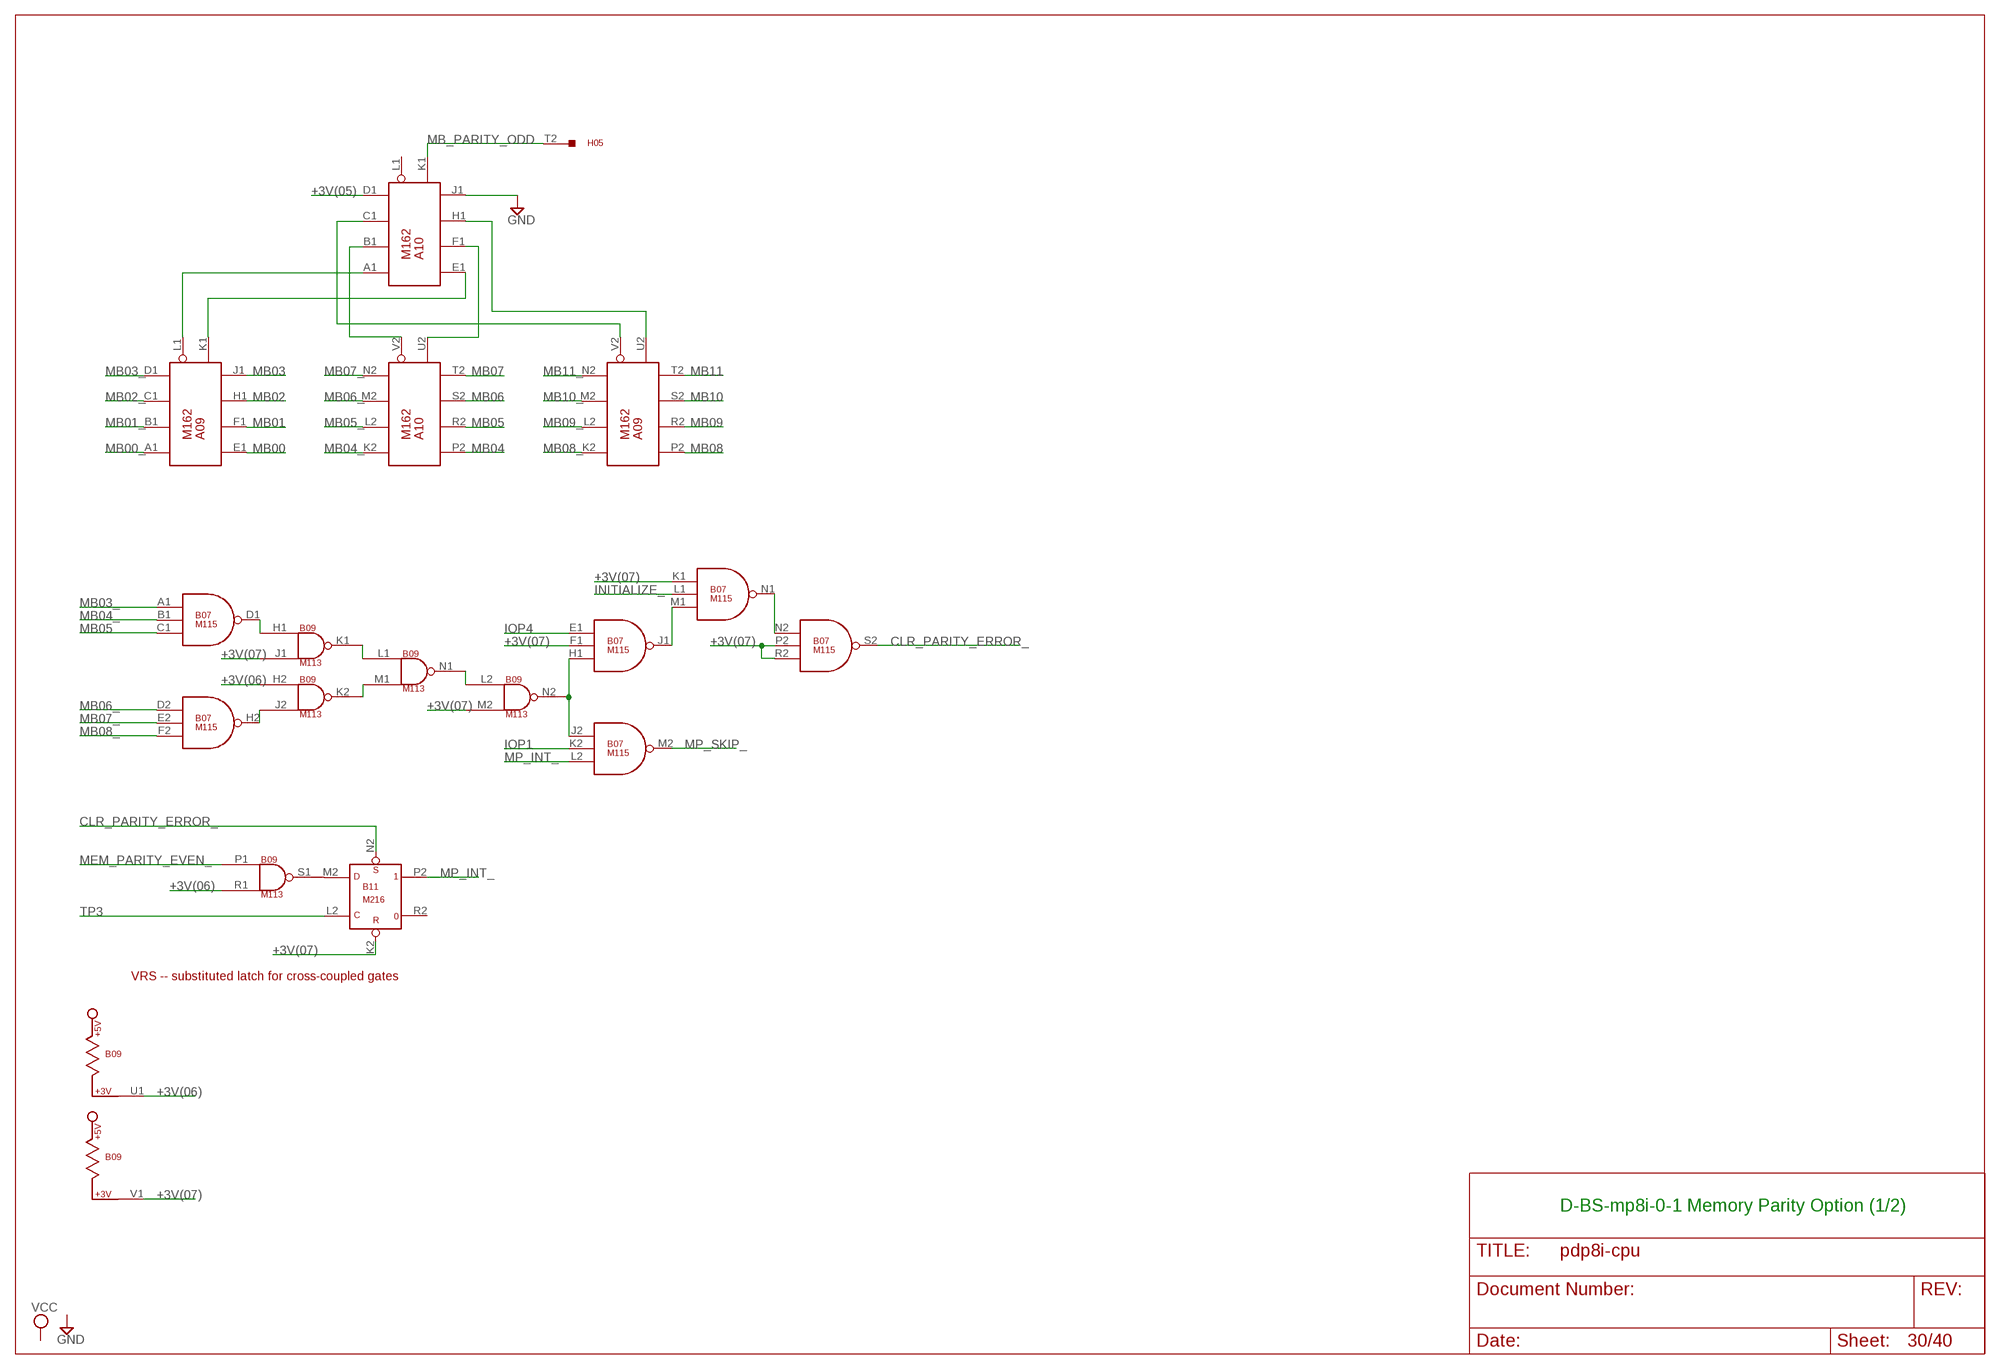
[diagram p30: schematic, sheet 30]

### Parts
A09  M162  [H807]
A10  M162  [H807]
B07  M115  [H807]
B09  M113  [H807]

### Nets
+3V(05): A10.D1(K1:8B) ; also sheet 31
+3V(06): B09.H2(K2:IN1) B09.R1(S1:IN2) B09.U1 ; also sheet 31
+3V(07): B07.F1(J1:IN2) B07.K1(N1:IN1) B07.P2(S2:IN2) B07.R2(S2:IN3) B09.J1(K1:IN2) B09.M2(N2:IN2) B09.V1 B11.K2(P2:R)
CLR_PARITY_ERROR_: B07.S2(S2:OUT) B11.N2(P2:S)
GND [Suppply]: A10.J1(K1:8A) ; also sheet 2,5,9,10,11,12,13,14,22,26,27
INITIALIZE_: B07.L1(N1:IN2) ; also sheet 2,14,26,32
IOP1: B07.K2(M2:IN2) ; also sheet 2
IOP4: B07.E1(J1:IN1) ; also sheet 2
MB00: A09.E1(K1:1A) ; also sheet 9,14,21
MB00_: A09.A1(K1:1B) ; also sheet 9
MB01: A09.F1(K1:2A) ; also sheet 9,14,21
MB01_: A09.B1(K1:2B) ; also sheet 9
MB02: A09.H1(K1:4A) ; also sheet 9,14,21
MB02_: A09.C1(K1:4B) ; also sheet 9
MB03: A09.J1(K1:8A) ; also sheet 4,5,9,14,21,27,29
MB03_: A09.D1(K1:8B) B07.A1(D1:IN1) ; also sheet 4,5,6,7,8,9,14,22,32
MB04: A10.P2(U2:1A) ; also sheet 5,9,14,21,22
MB04_: A10.K2(U2:1B) B07.B1(D1:IN2) ; also sheet 5,8,9,14,27,29,32
MB05: A10.R2(U2:2A) B07.C1(D1:IN3) ; also sheet 5,7,9,14,21,27,32
MB05_: A10.L2(U2:2B) ; also sheet 5,8,9,14,22,29
MB06: A10.S2(U2:4A) ; also sheet 5,7,9,14,21,22,27
MB06_: A10.M2(U2:4B) B07.D2(H2:IN1) ; also sheet 5,8,9,14,22,29,32
MB07: A10.T2(U2:8A) ; also sheet 5,7,9,14,21,22,26,27
MB07_: A10.N2(U2:8B) B07.E2(H2:IN2) ; also sheet 5,8,9,14,22,26,28,29,32
MB08: A09.P2(U2:1A) ; also sheet 6,7,9,14,21,22,26,27
MB08_: A09.K2(U2:1B) B07.F2(H2:IN3) ; also sheet 6,7,8,9,14,22,26,28,29,32
MB09: A09.R2(U2:2A) ; also sheet 2,5,6,9,14,21,22,27,29
MB09_: A09.L2(U2:2B) ; also sheet 6,9,26,27,28
MB10: A09.S2(U2:4A) ; also sheet 2,6,8,9,14,21,22,27,29
MB10_: A09.M2(U2:4B) ; also sheet 6,8,9,22,26,27,28
MB11: A09.T2(U2:8A) ; also sheet 2,6,9,14,21,22,27,29
MB11_: A09.N2(U2:8B) ; also sheet 2,5,7,8,9,22,26,28,29
MB_PARITY_ODD: A10.K1(K1:ODD) H05.T2
MEM_PARITY_EVEN_: B09.P1(S1:IN1) ; also sheet 31
MP_INT_: B07.L2(M2:IN3) B11.P2 ; also sheet 14
MP_SKIP_: B07.M2(M2:OUT) ; also sheet 14
N$26: B09.S1(S1:OUT) B11.M2(P2:D)
N$262: A09.L1(K1:EVEN) A10.A1(K1:1B)
N$687: A09.K1(K1:ODD) A10.E1(K1:1A)
N$689: A10.B1(K1:2B) A10.V2(U2:EVEN)
N$690: A10.F1(K1:2A) A10.U2(U2:ODD)
N$691: A09.V2(U2:EVEN) A10.C1(K1:4B)
N$692: A09.U2(U2:ODD) A10.H1(K1:4A)
N$693: B07.D1(D1:OUT) B09.H1(K1:IN1)
N$694: B07.H2(H2:OUT) B09.J2(K2:IN2)
N$695: B09.K1(K1:OUT) B09.L1(N1:IN1)
N$696: B09.K2(K2:OUT) B09.M1(N1:IN2)
N$697: B07.H1(J1:IN3) B07.J2(M2:IN1) B09.N2(N2:OUT)
N$698: B09.L2(N2:IN1) B09.N1(N1:OUT)
N$699: B07.J1(J1:OUT) B07.M1(N1:IN3)
N$700: B07.N1(N1:OUT) B07.N2(S2:IN1)
TP3: B11.L2(P2:C) ; also sheet 2,7,21,22,26,27,29
Unconnected: A10.L1(K1:EVEN) B07.P1(U1:IN1) B07.R1(U1:IN2) B07.S1(U1:IN3) B07.T2(V1:IN1) B07.U1(U1:OUT) B07.U2(V1:IN2) B07.V1(V1:OUT) B07.V2(V1:IN3) B09.P2(S2:IN1) B09.R2(S2:IN2) B09.S2(S2:OUT) B09.T2(V2:IN1) B09.U2(V2:IN2) B09.V2(V2:OUT) B11.R2

### Notes on the sheet
- VRS -- substituted latch for cross-coupled gates
- D-BS-mp8i-0-1 Memory Parity Option (1/2)

## Sheet 31 of 40
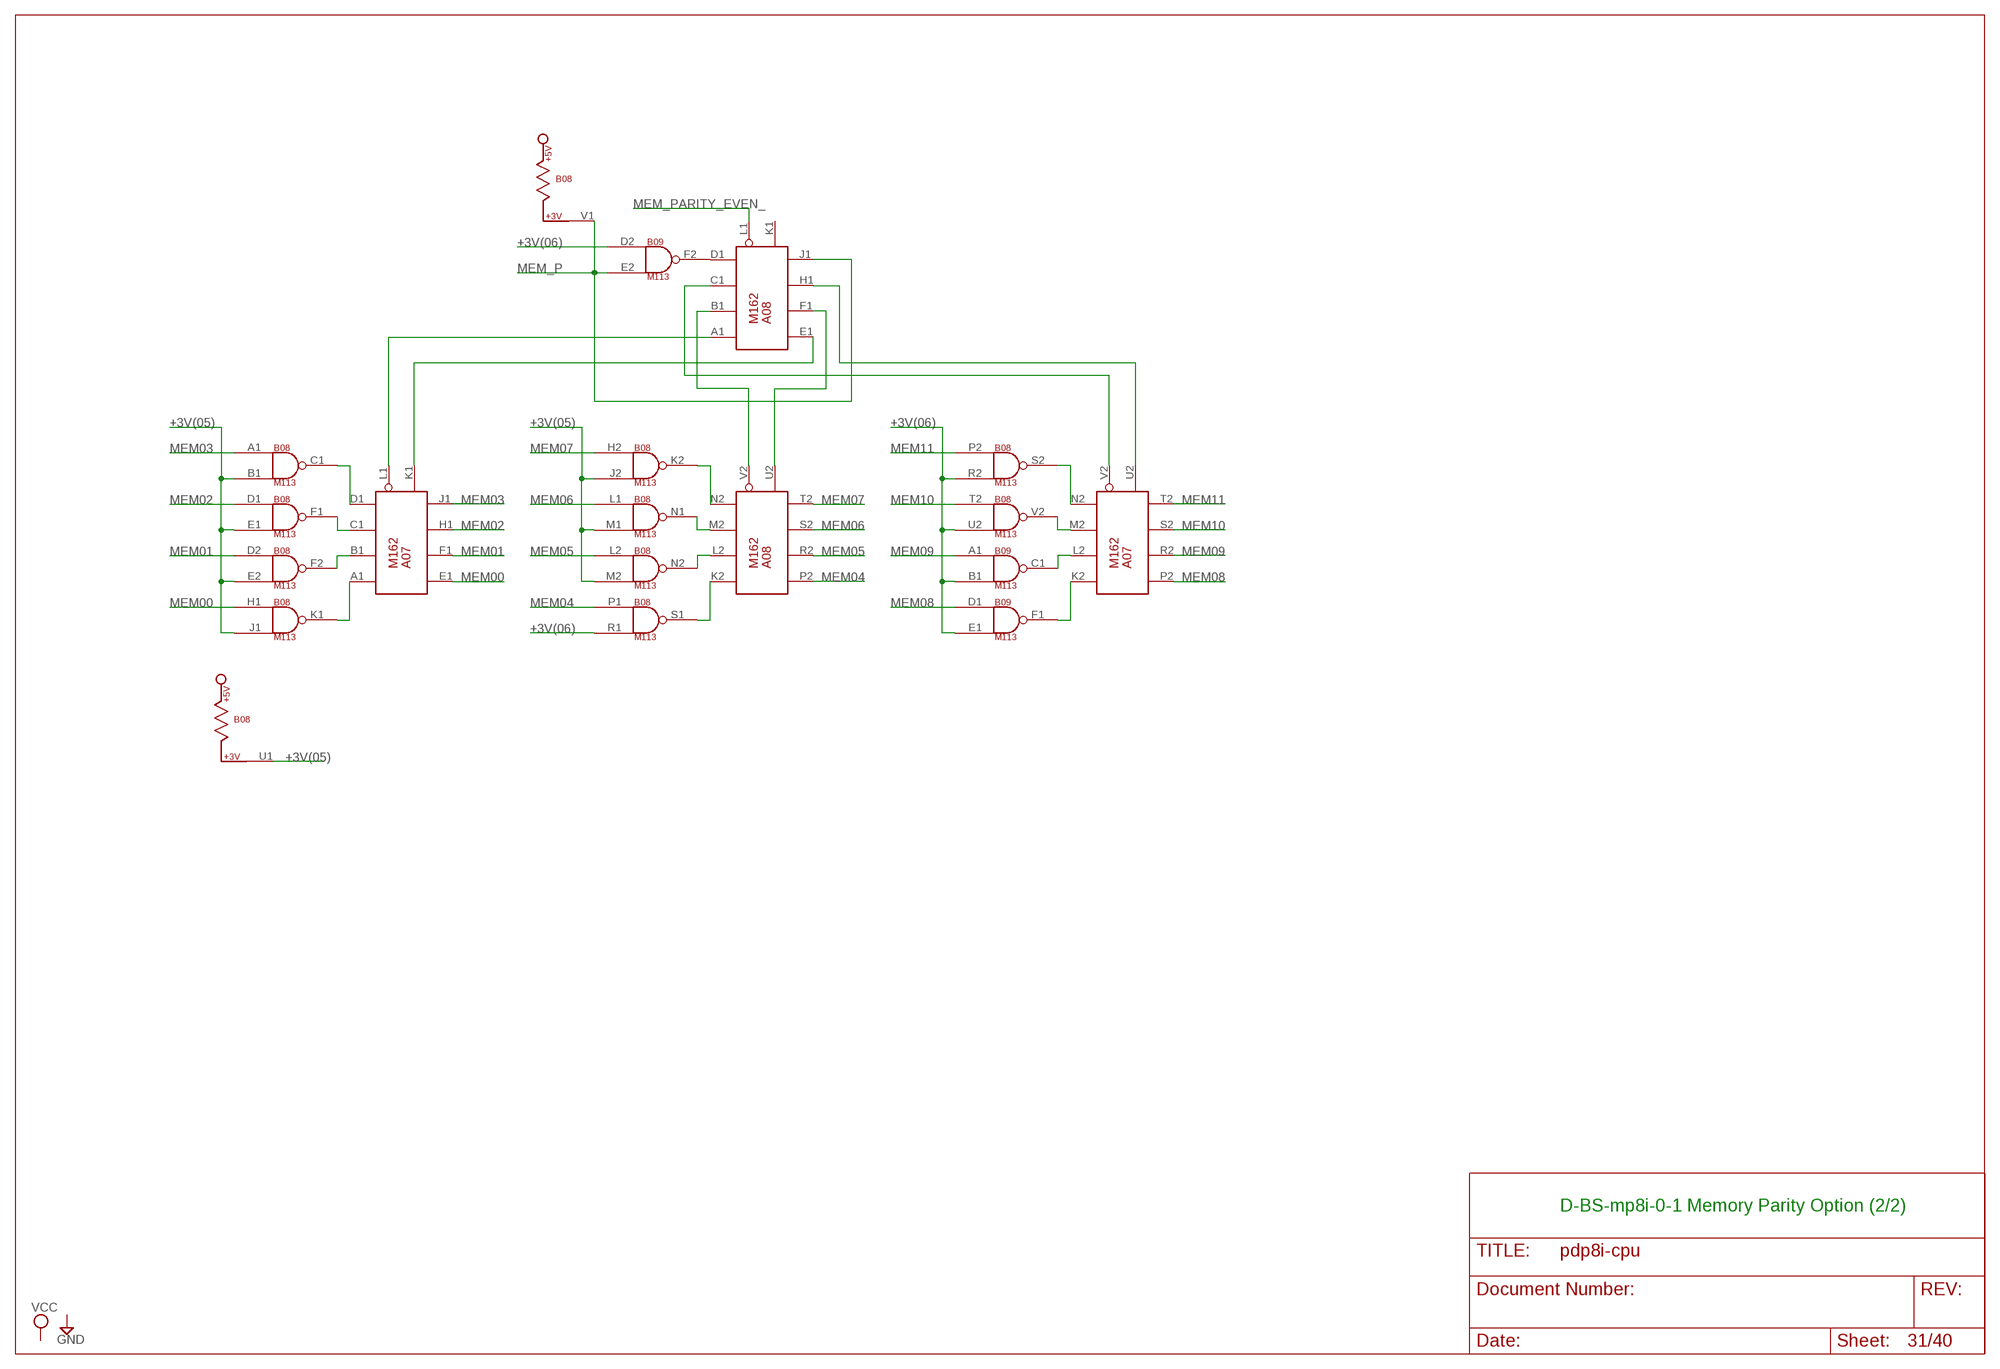
[diagram p31: schematic, sheet 31]

### Parts
A07  M162  [H807]
A08  M162  [H807]
B08  M113  [H807]

### Nets
+3V(05): B08.B1(C1:IN2) B08.E1(F1:IN2) B08.E2(F2:IN2) B08.J1(K1:IN2) B08.J2(K2:IN2) B08.M1(N1:IN2) B08.M2(N2:IN2) B08.U1 ; also sheet 30
+3V(06): B08.R1(S1:IN2) B08.R2(S2:IN2) B08.U2(V2:IN2) B09.B1(C1:IN2) B09.D2(F2:IN1) B09.E1(F1:IN2) ; also sheet 30
MEM00: A07.E1(K1:1A) B08.H1(K1:IN1) ; also sheet 4,10,18,29
MEM01: A07.F1(K1:2A) B08.D2(F2:IN1) ; also sheet 4,10,18
MEM02: A07.H1(K1:4A) B08.D1(F1:IN1) ; also sheet 4,10,18
MEM03: A07.J1(K1:8A) B08.A1(C1:IN1) ; also sheet 11,18
MEM04: A08.P2(U2:1A) B08.P1(S1:IN1) ; also sheet 11,18
MEM05: A08.R2(U2:2A) B08.L2(N2:IN1) ; also sheet 11,18
MEM06: A08.S2(U2:4A) B08.L1(N1:IN1) ; also sheet 12,18
MEM07: A08.T2(U2:8A) B08.H2(K2:IN1) ; also sheet 12,18
MEM08: A07.P2(U2:1A) B09.D1(F1:IN1) ; also sheet 12,18
MEM09: A07.R2(U2:2A) B09.A1(C1:IN1) ; also sheet 13,18,29
MEM10: A07.S2(U2:4A) B08.T2(V2:IN1) ; also sheet 13,18
MEM11: A07.T2(U2:8A) B08.P2(S2:IN1) ; also sheet 13,18
MEM_P: A08.J1(K1:8A) B08.V1 B09.E2(F2:IN2) ; also sheet 18
MEM_PARITY_EVEN_: A08.L1(K1:EVEN) ; also sheet 30
N$702: A07.L1(K1:EVEN) A08.A1(K1:1B)
N$703: A07.K1(K1:ODD) A08.E1(K1:1A)
N$704: A08.B1(K1:2B) A08.V2(U2:EVEN)
N$705: A08.F1(K1:2A) A08.U2(U2:ODD)
N$706: A07.V2(U2:EVEN) A08.C1(K1:4B)
N$707: A07.U2(U2:ODD) A08.H1(K1:4A)
N$708: A08.M2(U2:4B) B08.N1(N1:OUT)
N$709: A08.L2(U2:2B) B08.N2(N2:OUT)
N$710: A08.K2(U2:1B) B08.S1(S1:OUT)
N$711: A08.N2(U2:8B) B08.K2(K2:OUT)
N$712: A07.M2(U2:4B) B08.V2(V2:OUT)
N$713: A07.B1(K1:2B) B08.F2(F2:OUT)
N$714: A07.C1(K1:4B) B08.F1(F1:OUT)
N$715: A07.D1(K1:8B) B08.C1(C1:OUT)
N$716: A07.A1(K1:1B) B08.K1(K1:OUT)
N$717: A07.L2(U2:2B) B09.C1(C1:OUT)
N$718: A07.K2(U2:1B) B09.F1(F1:OUT)
N$719: A07.N2(U2:8B) B08.S2(S2:OUT)
N$720: A08.D1(K1:8B) B09.F2(F2:OUT)
Unconnected: A08.K1(K1:ODD)

### Notes on the sheet
- D-BS-mp8i-0-1 Memory Parity Option (2/2)

## Sheet 32 of 40
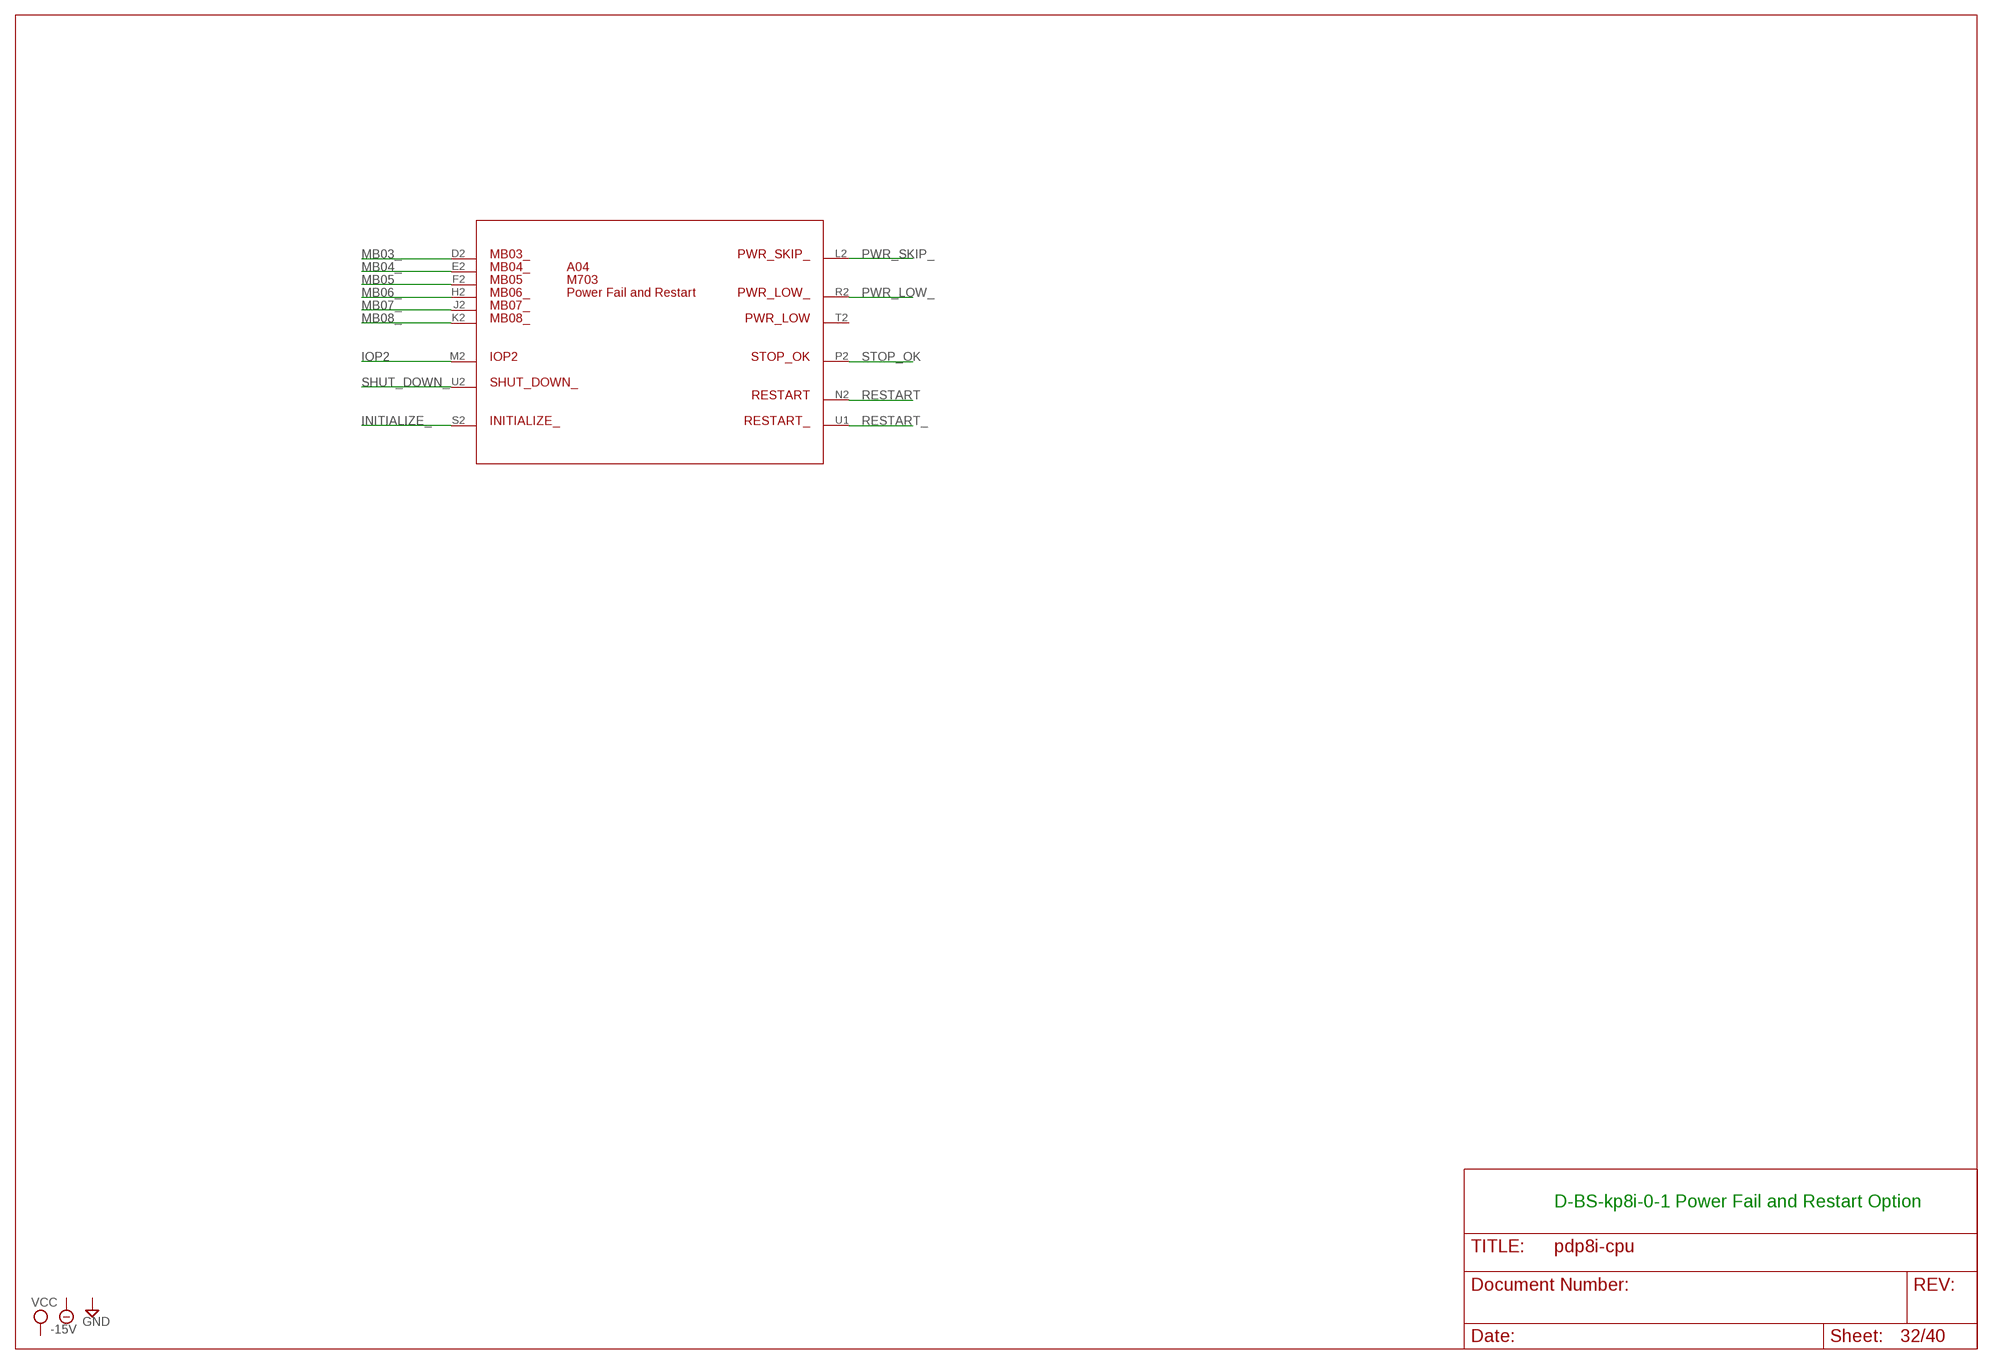
[diagram p32: schematic, sheet 32]

### Parts
A04  M703  [H807]

### Nets
INITIALIZE_: A04.S2 ; also sheet 2,14,26,30
IOP2: A04.M2 ; also sheet 2
MB03_: A04.D2 ; also sheet 4,5,6,7,8,9,14,22,30
MB04_: A04.E2 ; also sheet 5,8,9,14,27,29,30
MB05: A04.F2 ; also sheet 5,7,9,14,21,27,30
MB06_: A04.H2 ; also sheet 5,8,9,14,22,29,30
MB07_: A04.J2 ; also sheet 5,8,9,14,22,26,28,29,30
MB08_: A04.K2 ; also sheet 6,7,8,9,14,22,26,28,29,30
PWR_LOW_: A04.R2 ; also sheet 14
PWR_SKIP_: A04.L2 ; also sheet 14
RESTART: A04.N2 ; also sheet 21
RESTART_: A04.U1 ; also sheet 2,5
SHUT_DOWN_: A04.U2 ; also sheet 17
STOP_OK: A04.P2 ; also sheet 2,17
Unconnected: A04.T2

### Notes on the sheet
- D-BS-kp8i-0-1 Power Fail and Restart Option

## Sheet 33 of 40
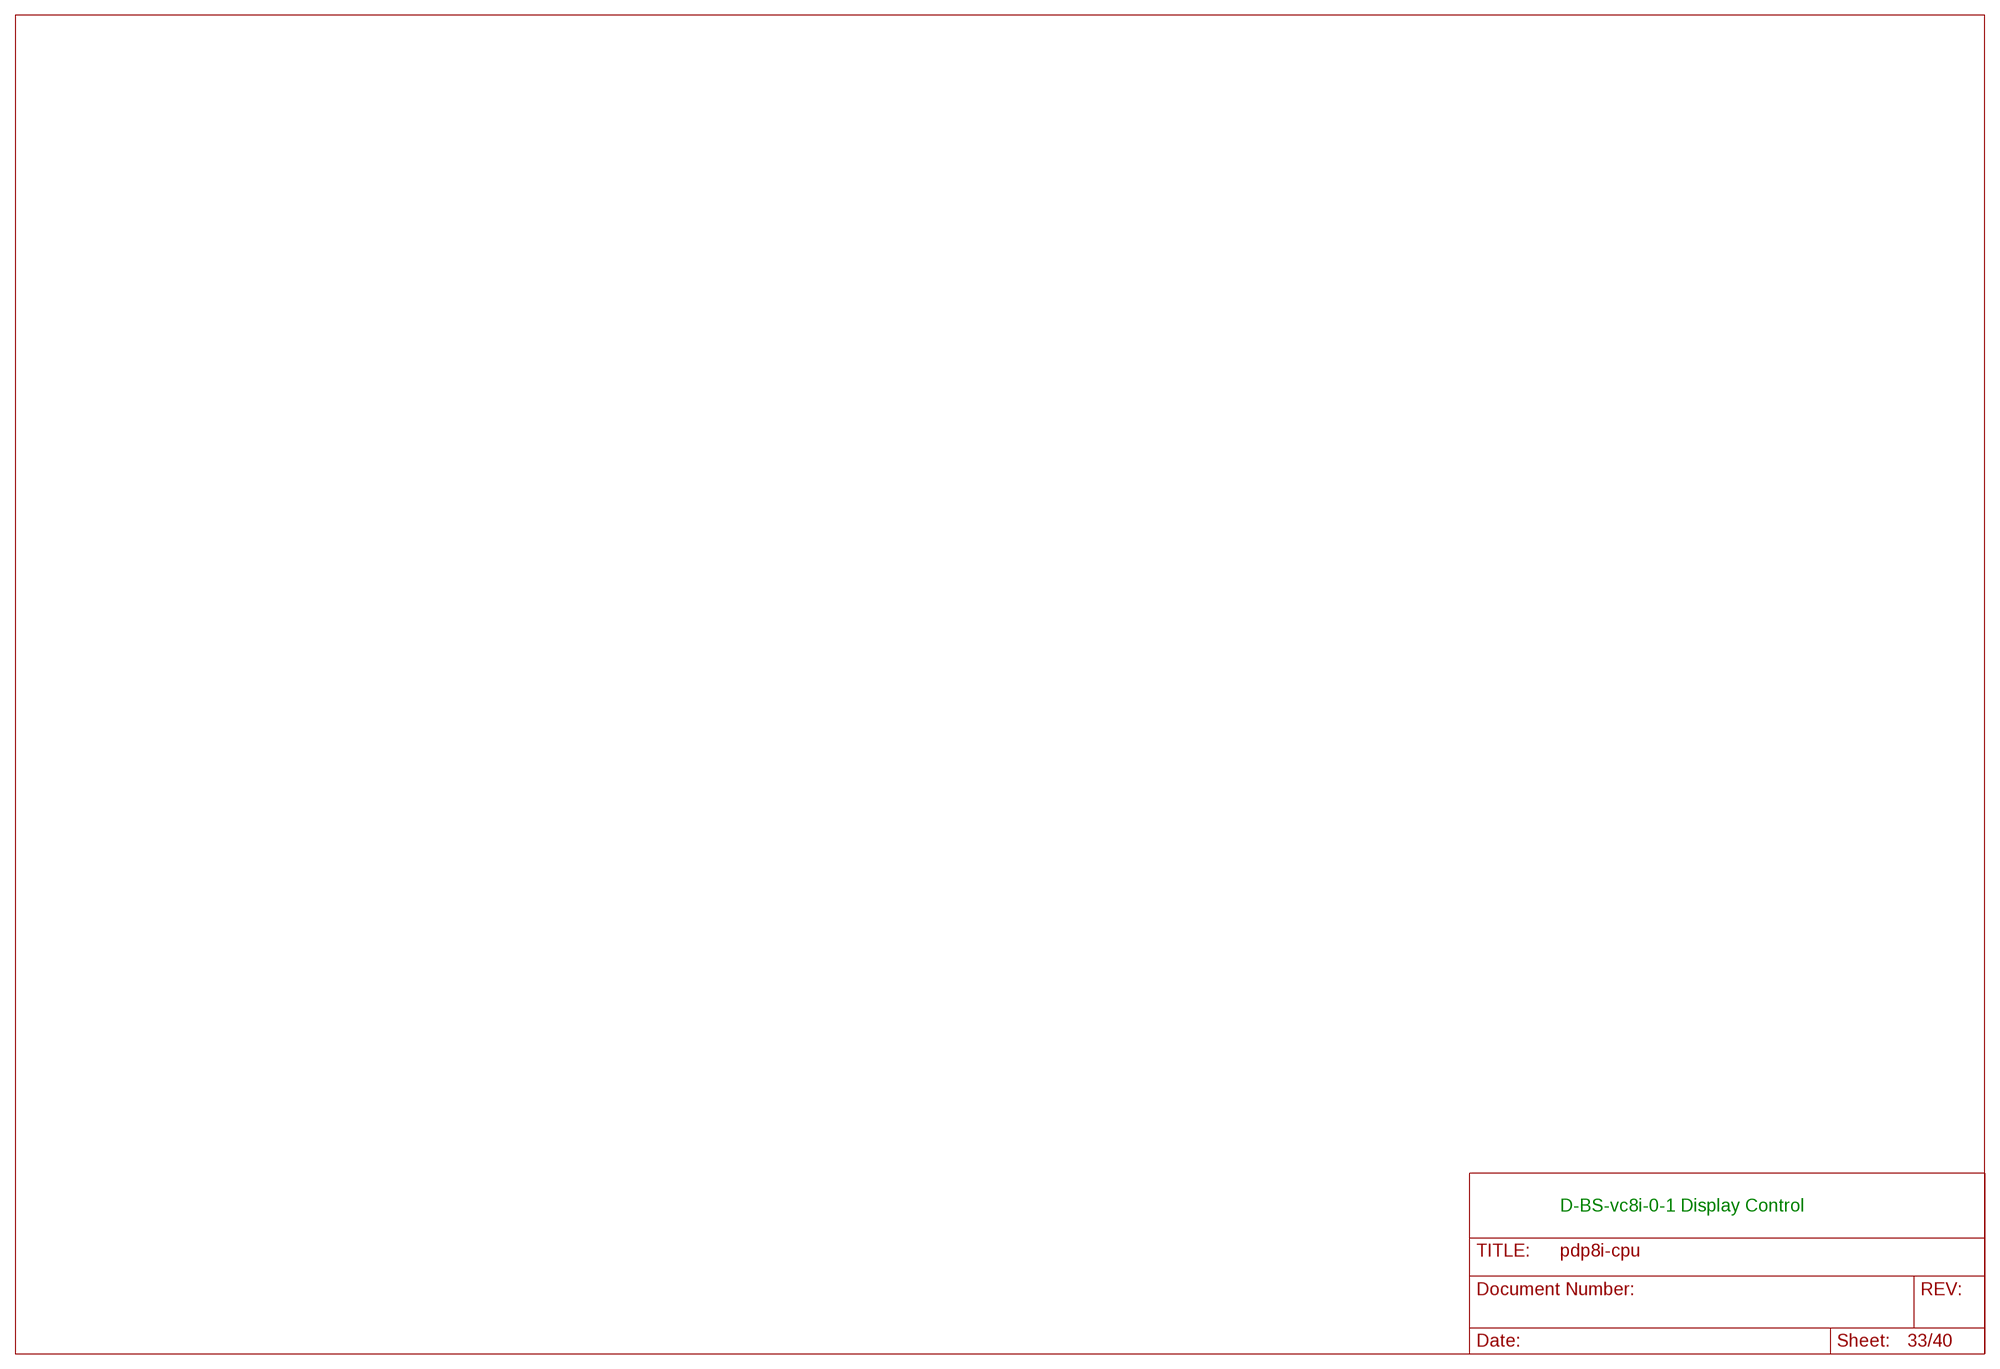
[diagram p33: schematic, sheet 33]

### Notes on the sheet
- D-BS-vc8i-0-1 Display Control

## Sheet 34 of 40
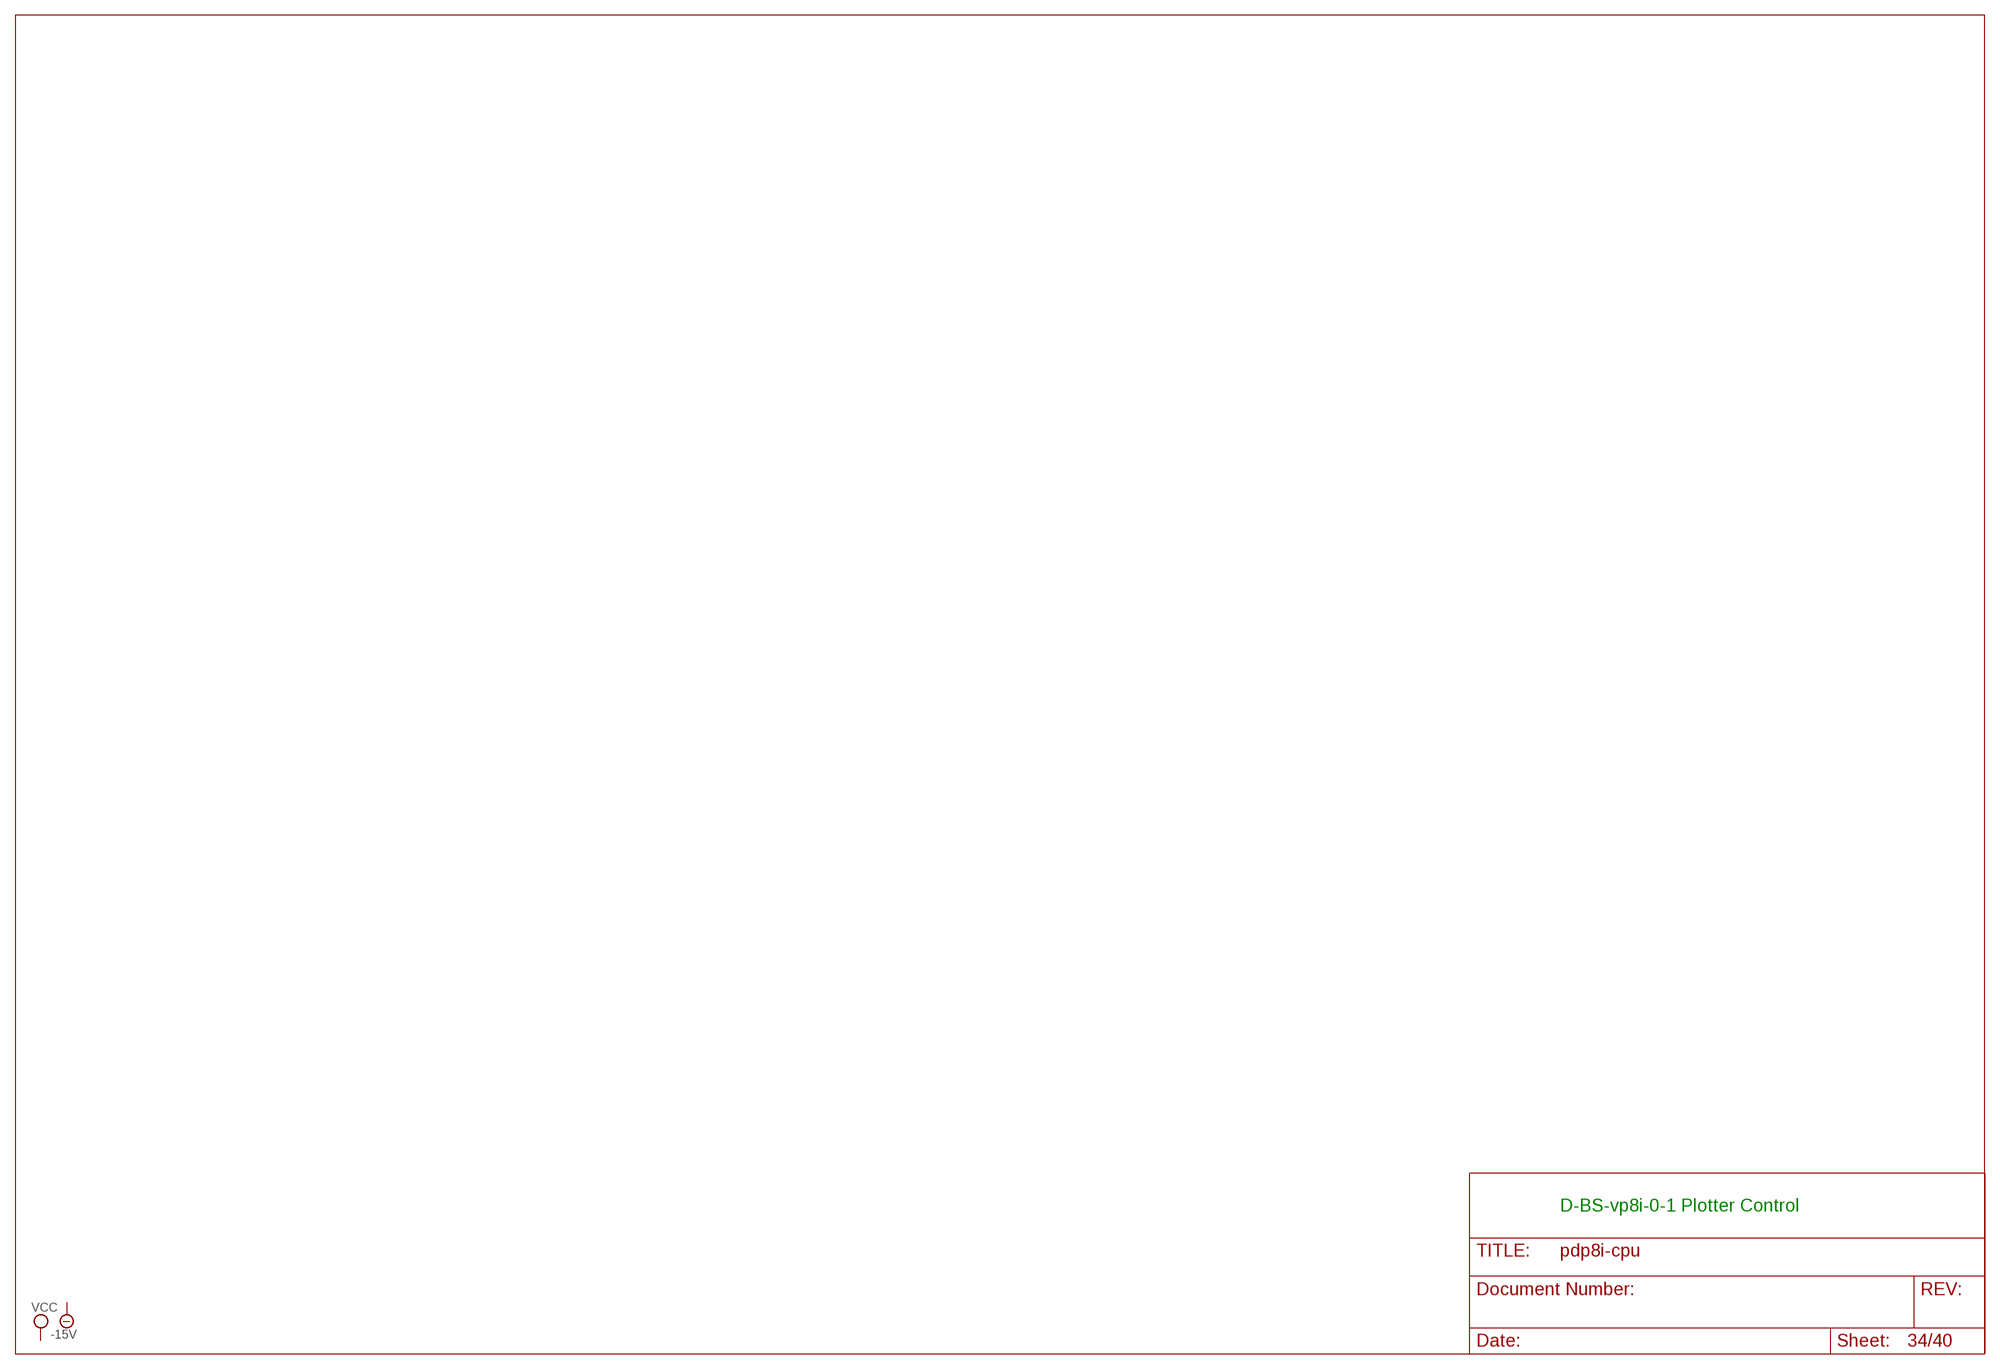
[diagram p34: schematic, sheet 34]

### Notes on the sheet
- D-BS-vp8i-0-1 Plotter Control

## Sheet 35 of 40
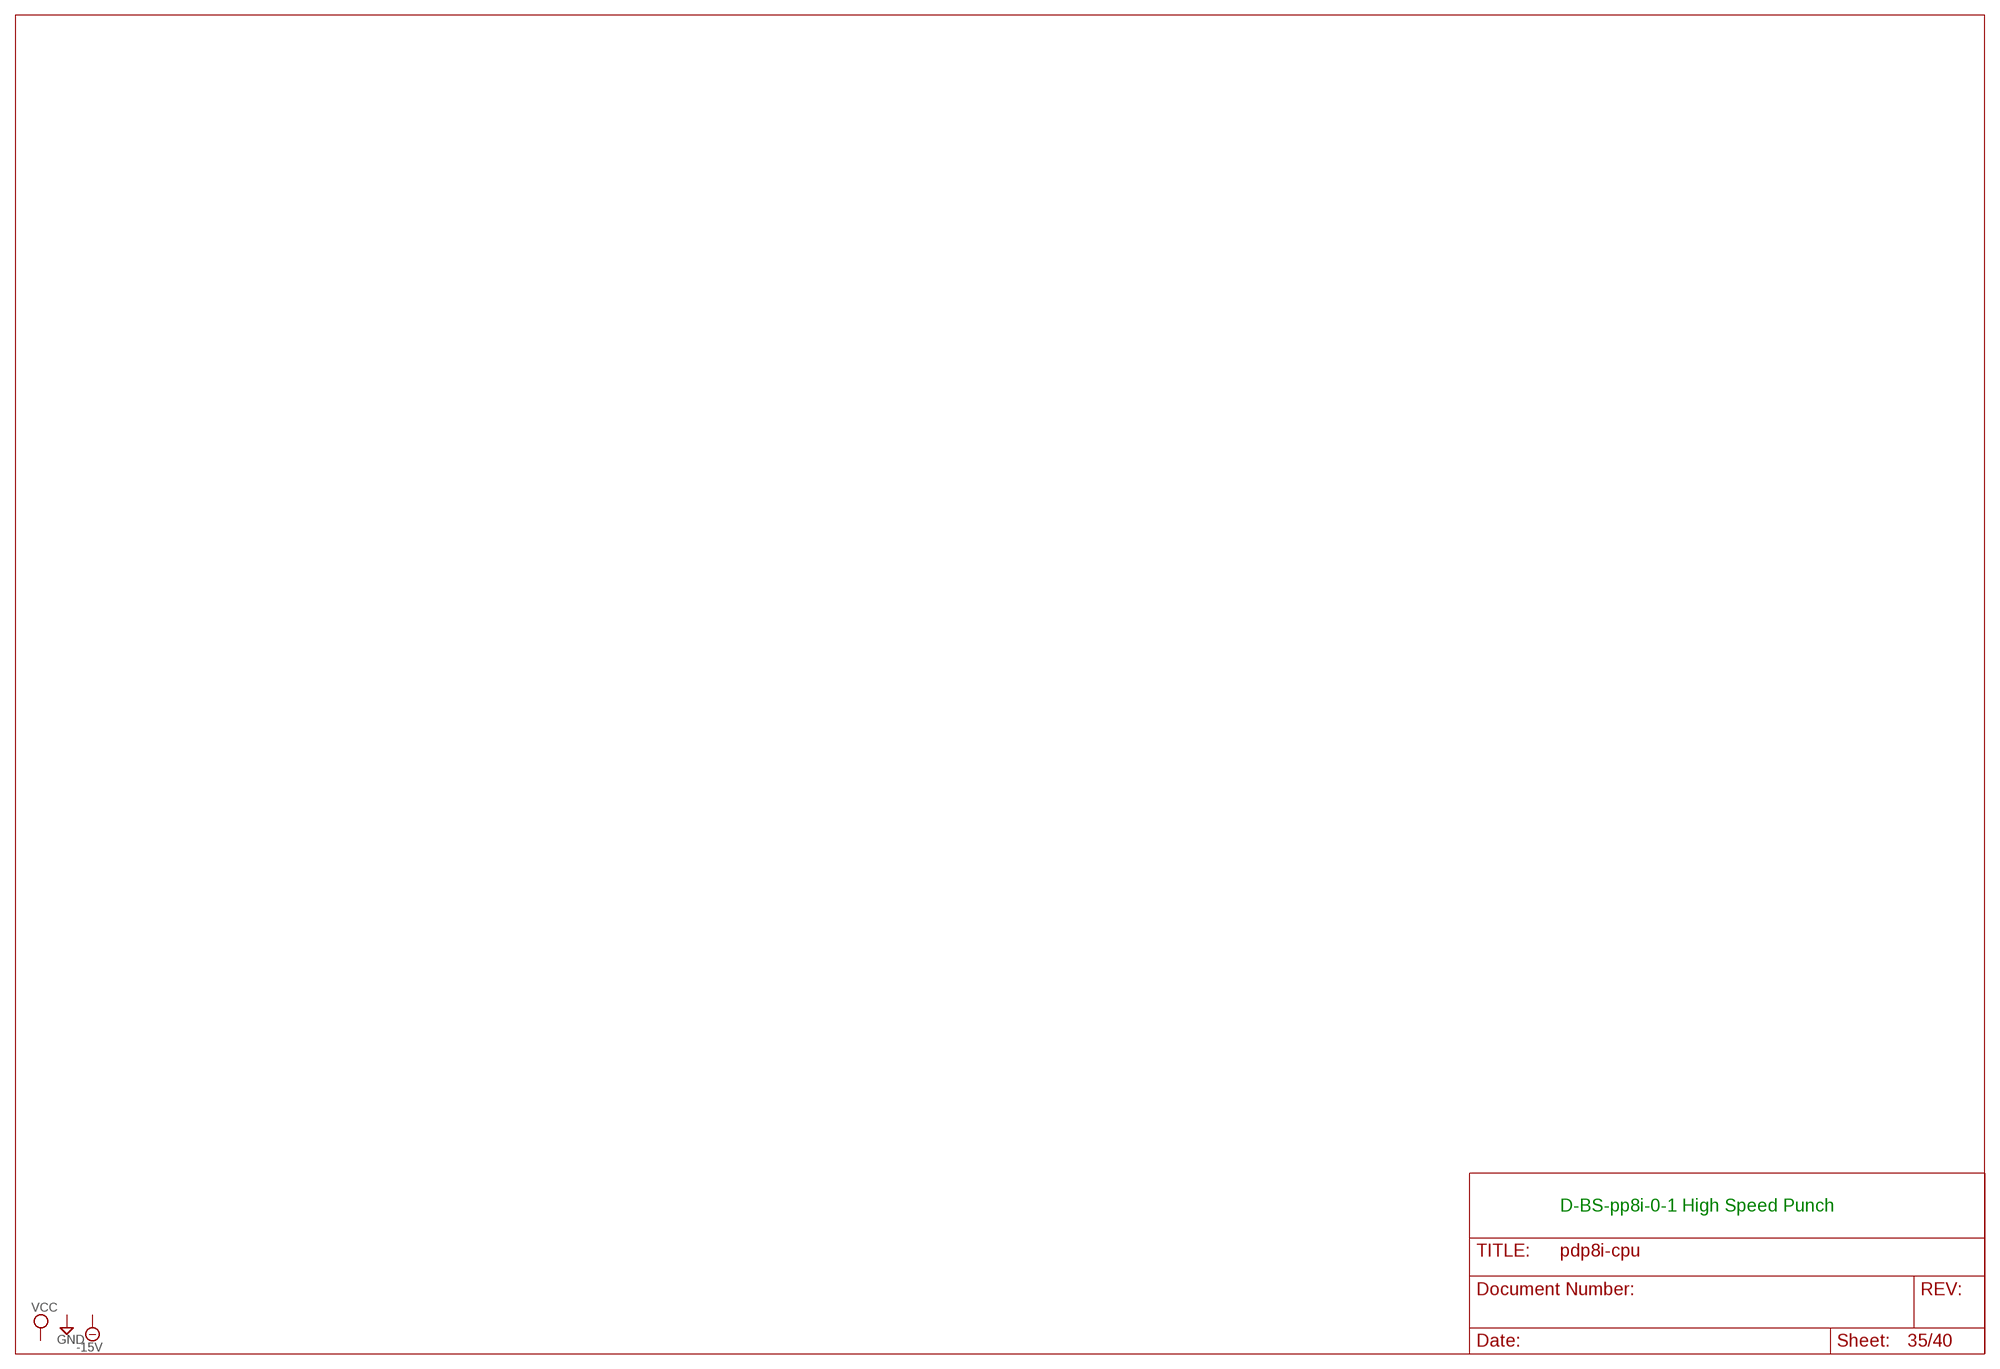
[diagram p35: schematic, sheet 35]

### Notes on the sheet
- D-BS-pp8i-0-1 High Speed Punch

## Sheet 36 of 40
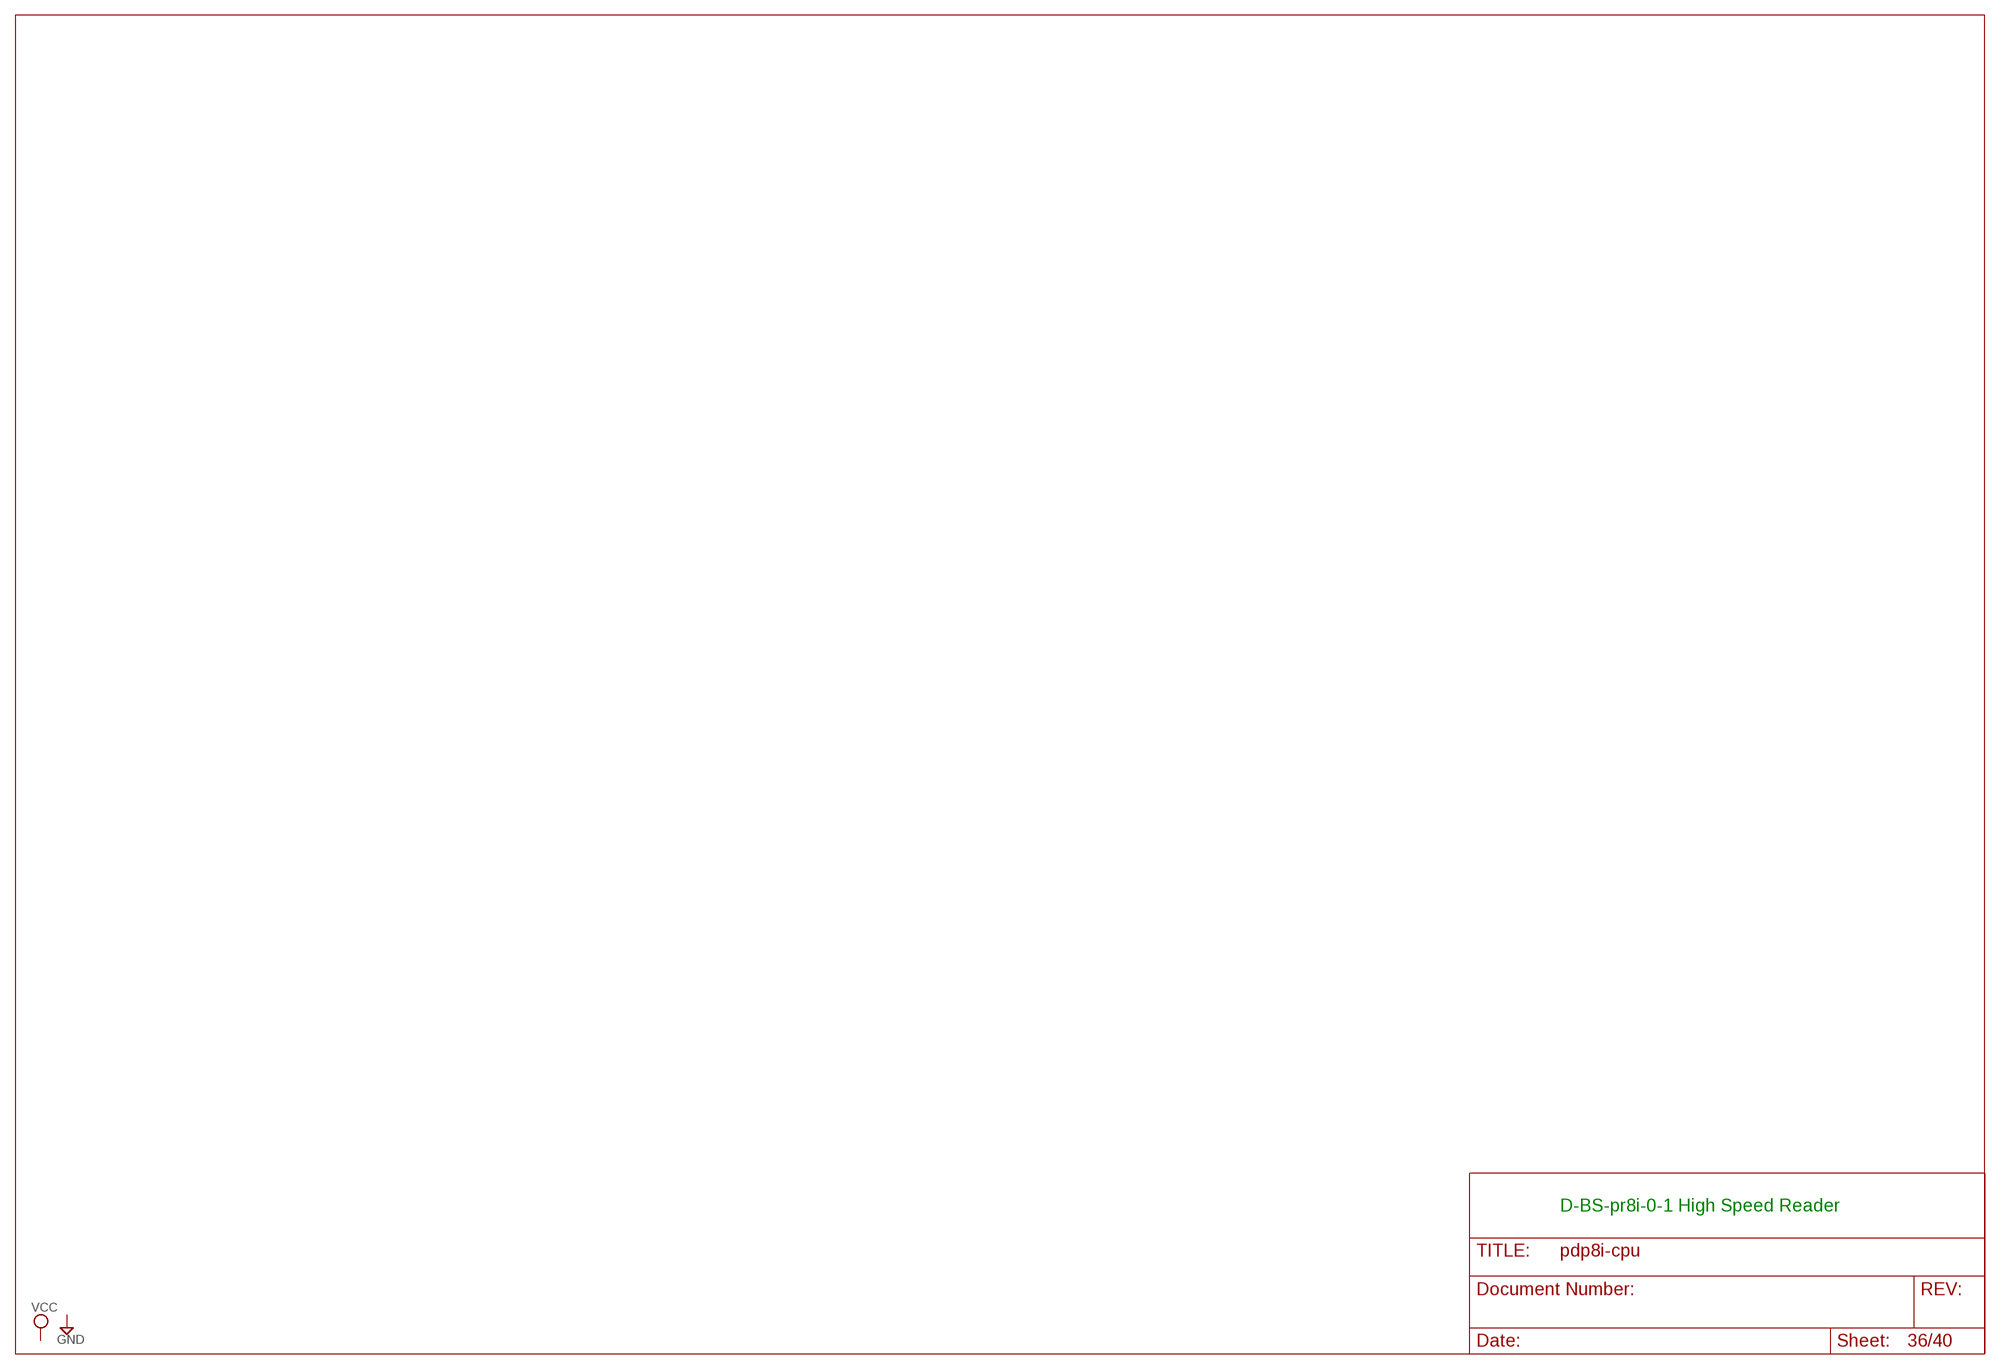
[diagram p36: schematic, sheet 36]

### Notes on the sheet
- D-BS-pr8i-0-1 High Speed Reader

## Sheet 37 of 40
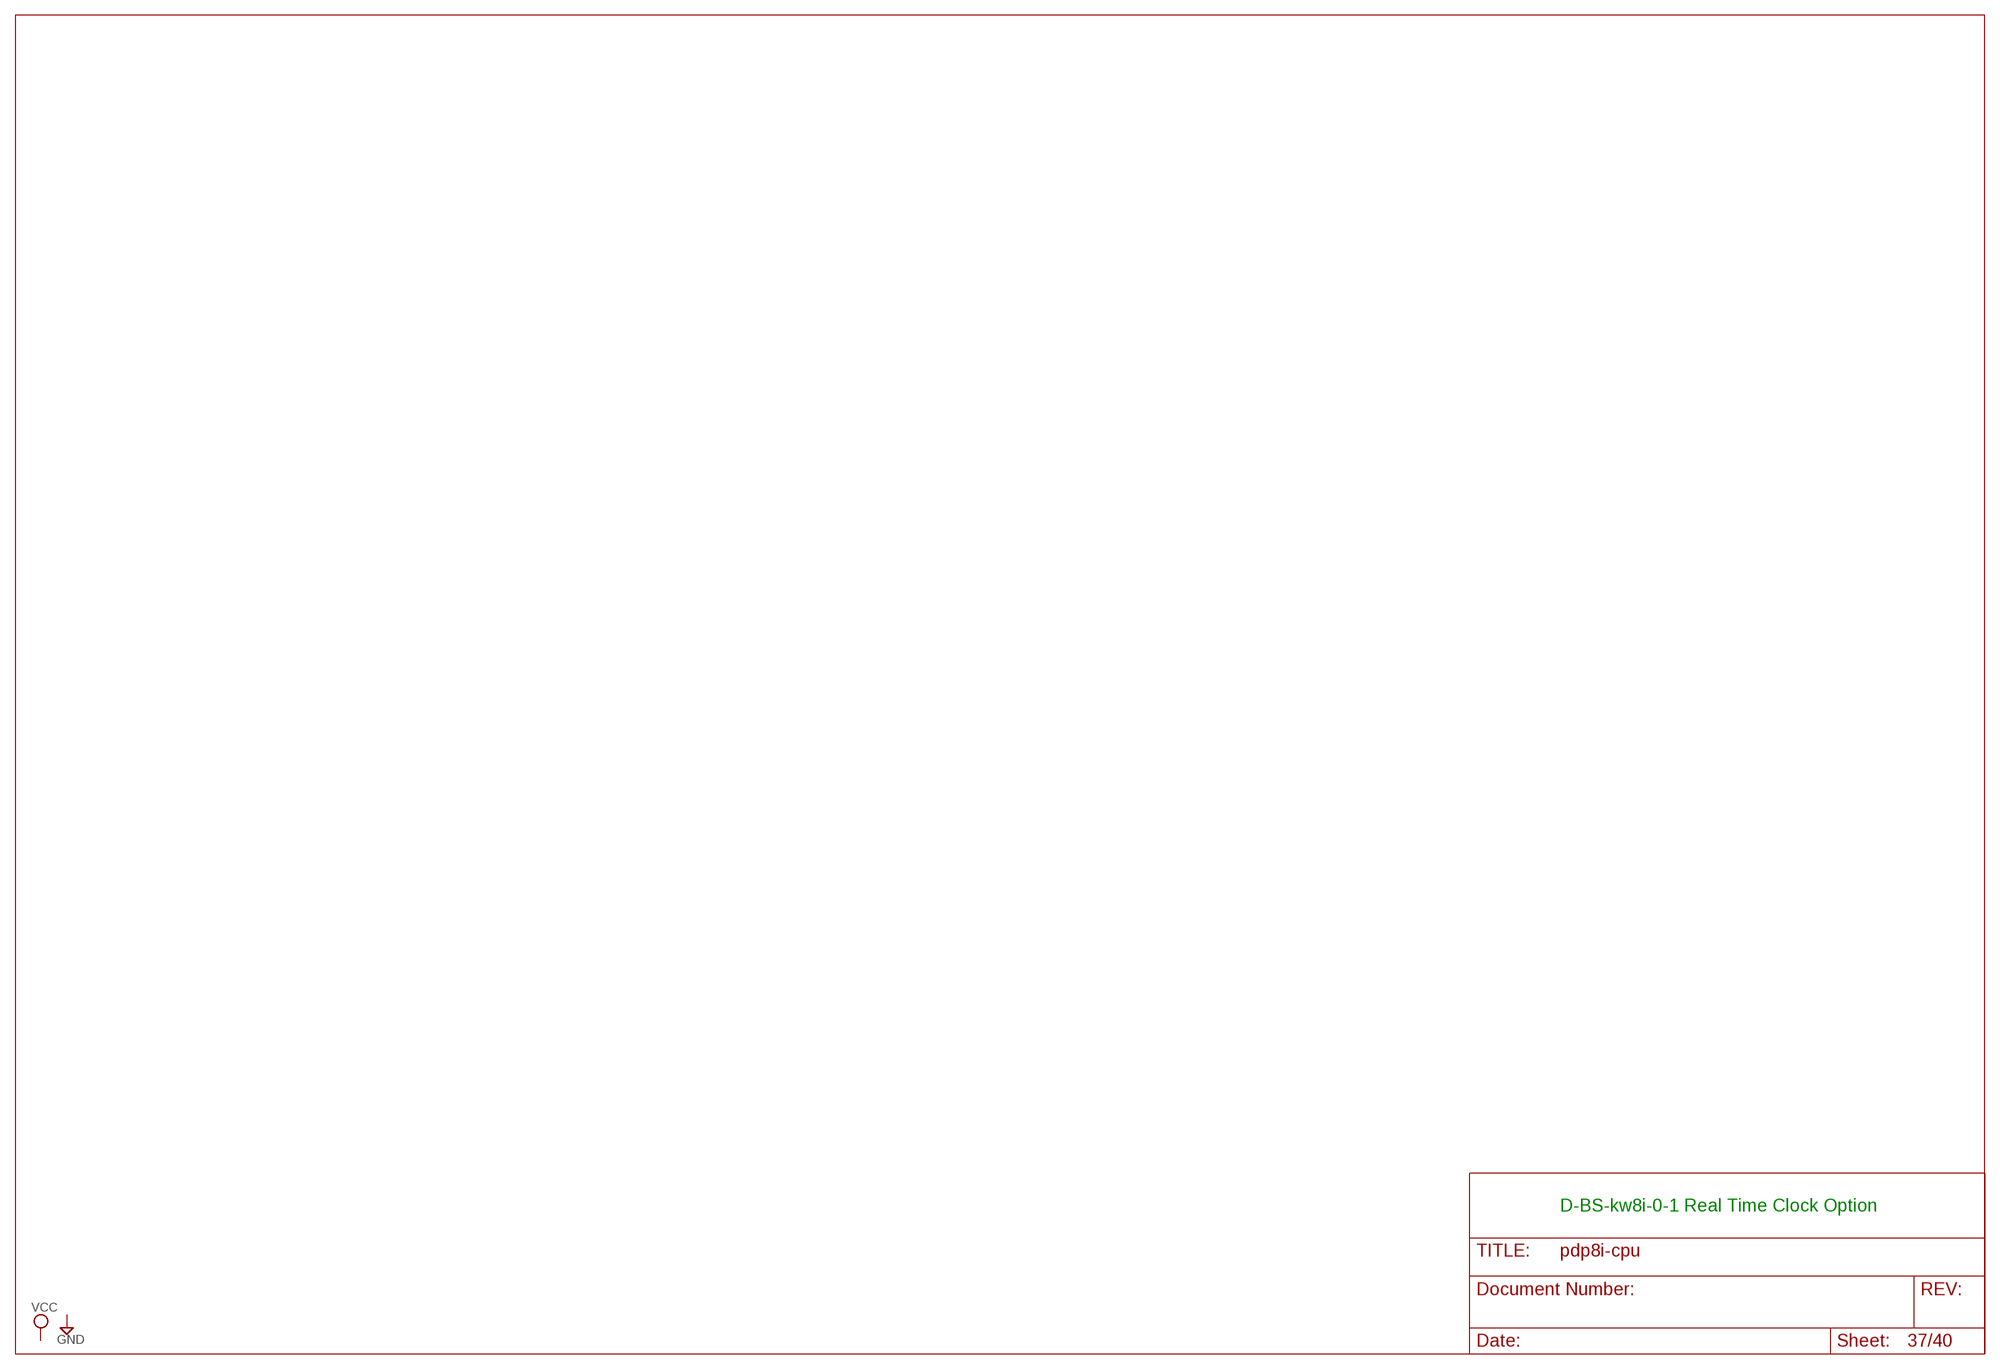
[diagram p37: schematic, sheet 37]

### Notes on the sheet
- D-BS-kw8i-0-1 Real Time Clock Option

## Sheet 38 of 40
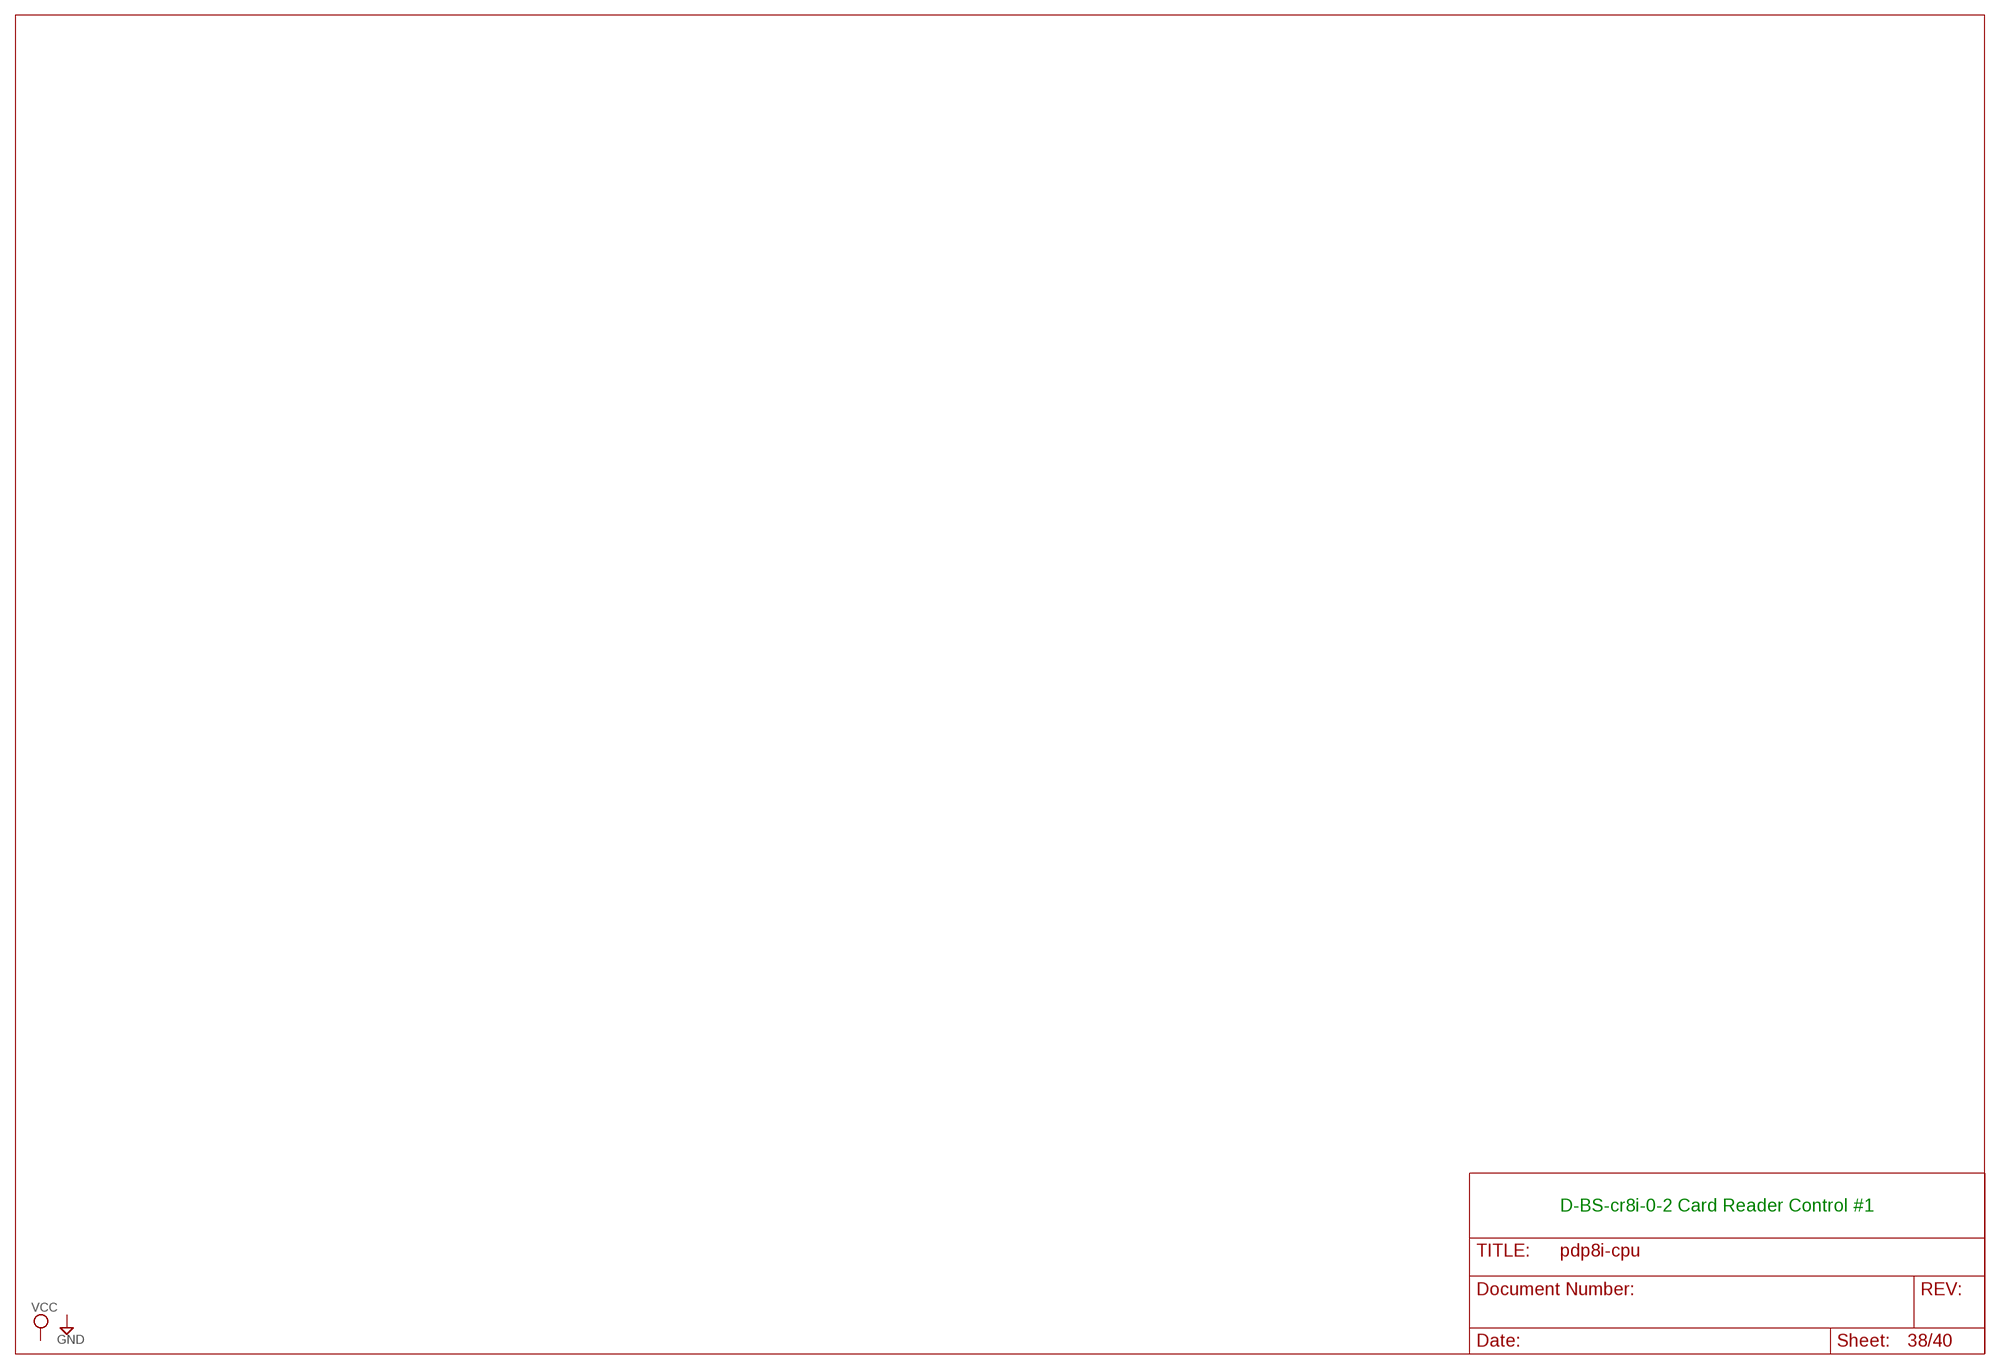
[diagram p38: schematic, sheet 38]

### Notes on the sheet
- D-BS-cr8i-0-2 Card Reader Control #1

## Sheet 39 of 40
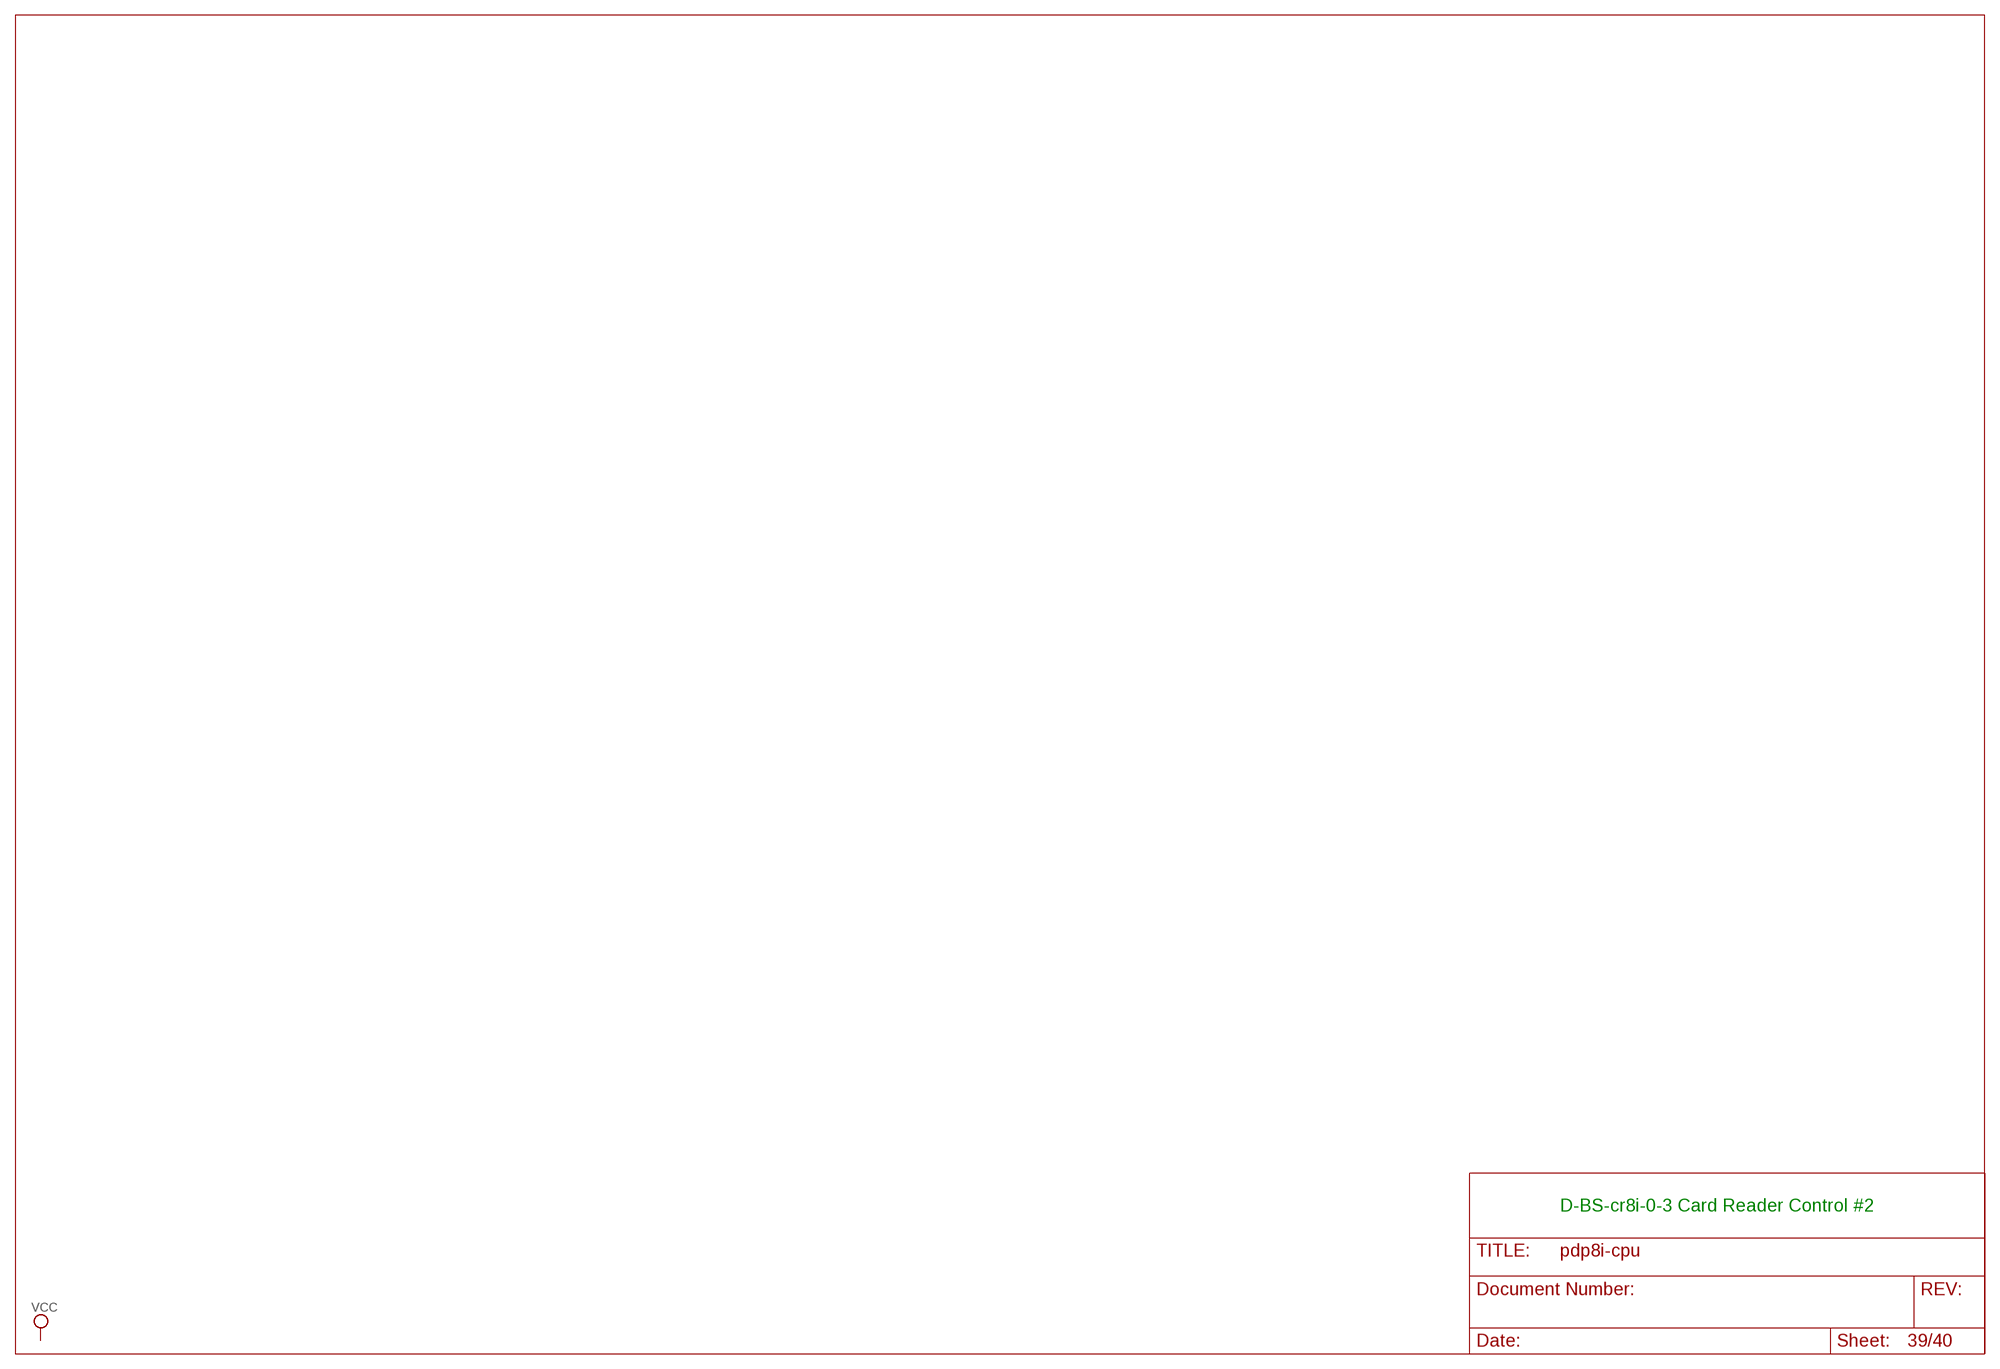
[diagram p39: schematic, sheet 39]

### Notes on the sheet
- D-BS-cr8i-0-3 Card Reader Control #2

## Sheet 40 of 40
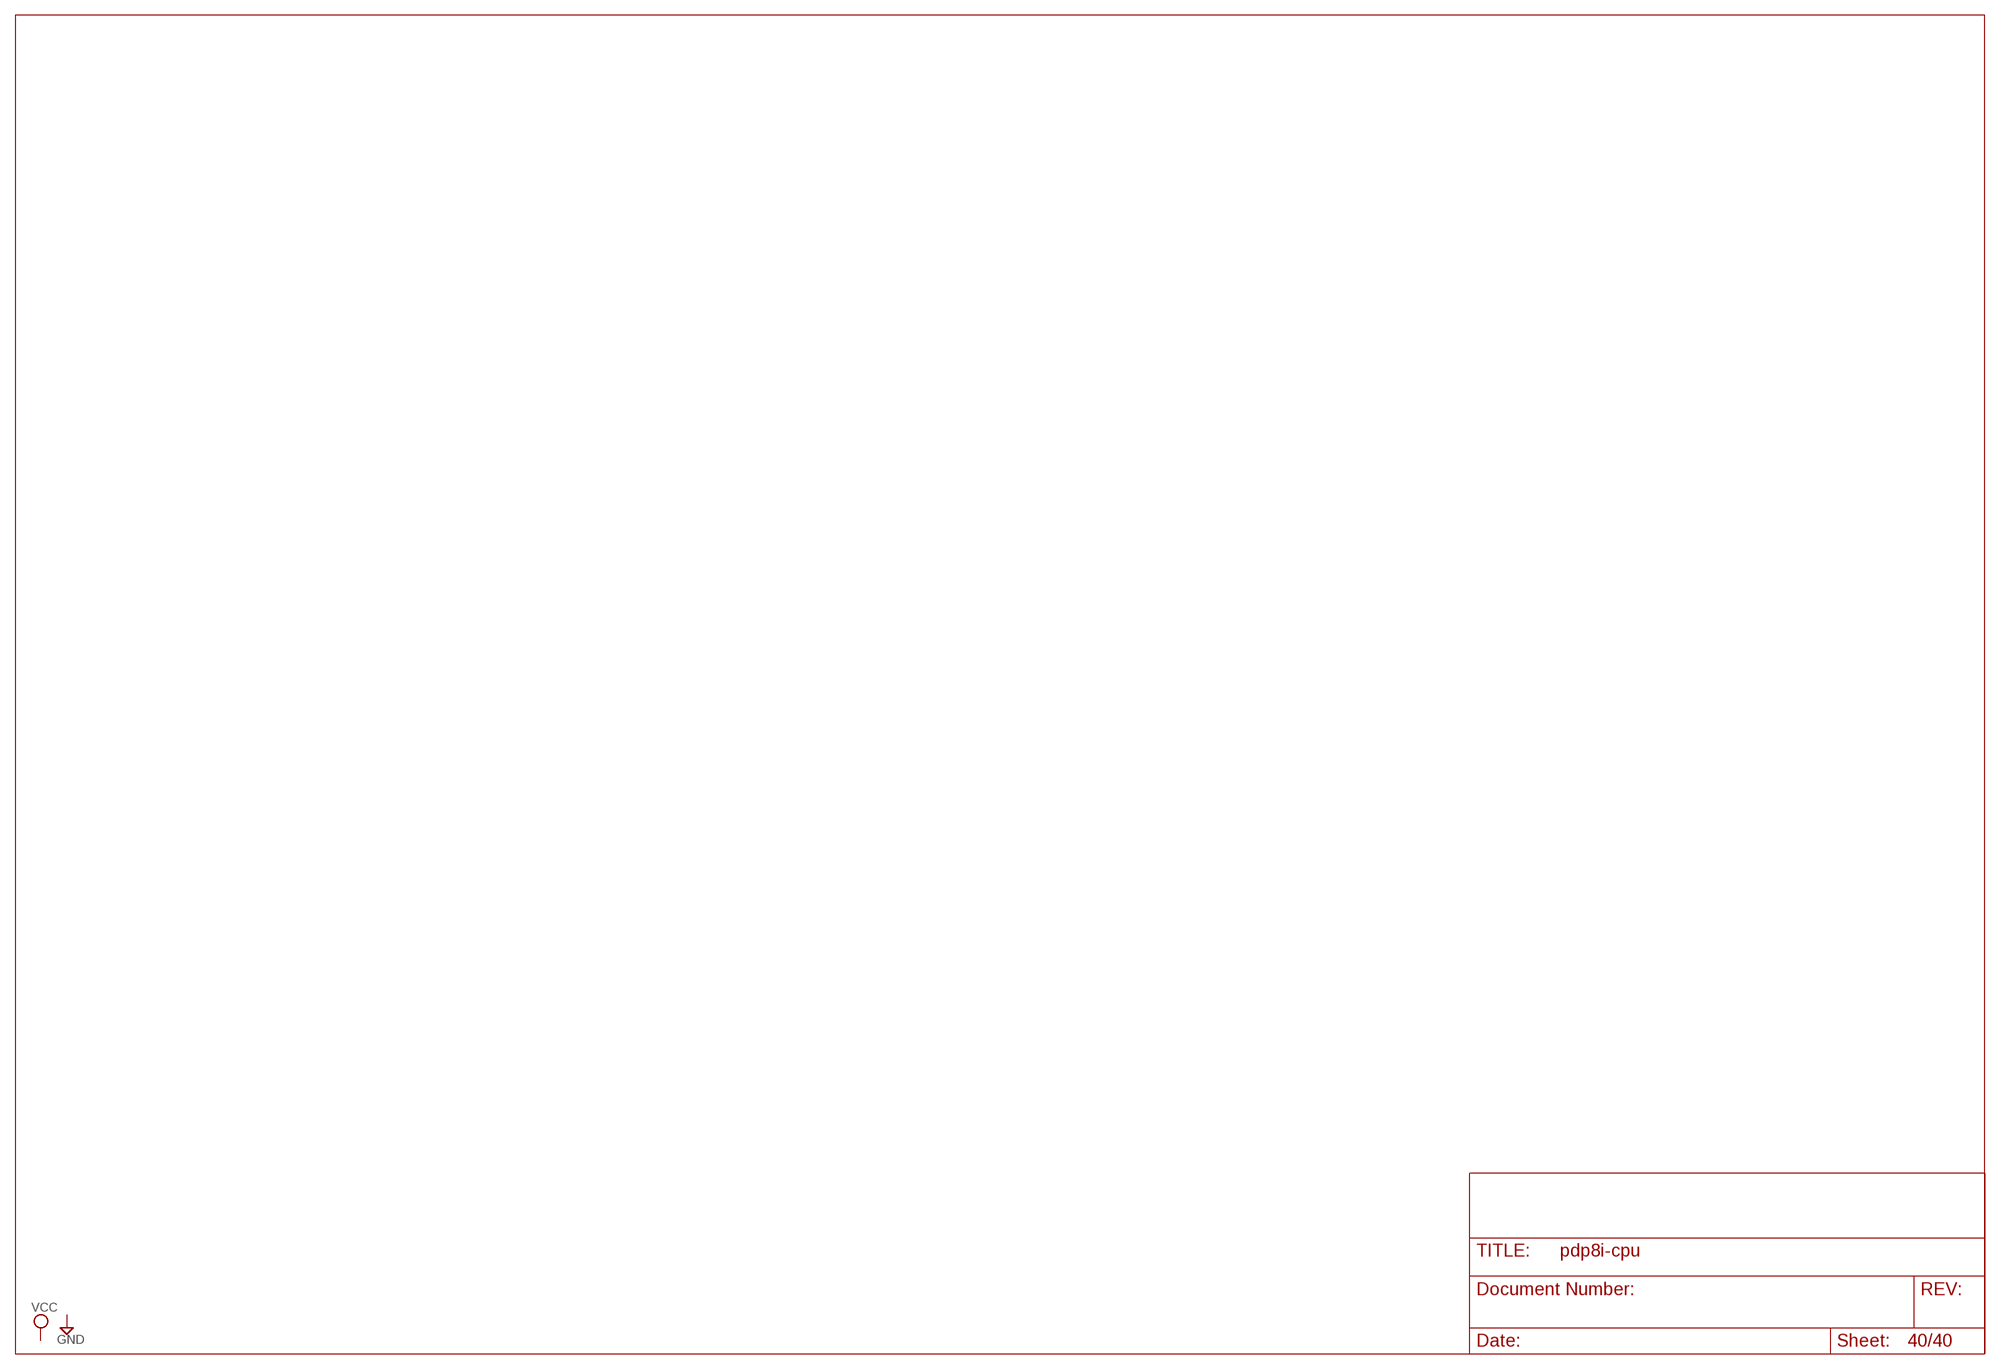
[diagram p40: schematic, sheet 40]

## Power pins joined to a net without a drawn wire
-15V: AB02.AB2(-15V) AB03.BK2(-15V) AB03.BL2(-15V) AB03.BM2(-15V) AB03.BN2(-15V) AB03.BP2(-15V) AB03.BR2(-15V) AB03.BS2(-15V) AB03.BT2(-15V) AB03.BU2(-15V) AB03.BV2(-15V) C07.B2(-15V) E03.B2 E04.B2 E05.B2 E06.B2 E07.B2 E08.B2 F04.B2 F05.B2 F06.B2 F07.B2 H06.B2 H07.B2(-15V) H08.B2(-15V) H09.B2(-15V) H10.B2(-15V) H11.B2(-15V) H12.B2(-15V) H13.B2(-15V) H14.B2(-15V) H15.B2(-15V) H16.B2(-15V) H17.B2(-15V) H18.B2(-15V) H19.B2(-15V) H20.B2(-15V) H21.B2 H22.B2 H33.B2 H35.B2 H36.B2 H37.B2 H38.B2 H39.B2 H40.B2 J13.B2(-15V) J14.B2(-15V) J15.B2(-15V) J16.B2(-15V) J17.B2(-15V) J18.B2(-15V) J19.B2(-15V) J20.B2(-15V) J21.B2 J22.B2 J35.B2 J36.B2 J37.B2 J38.B2 J39.B2 J40.B2
GND: A04.C2(GND) A04.T1(GND) A05.C2(GND) A05.T1(GND) A06.C2(GND) A06.T1(GND) A07.C2(GND) A07.T1(GND) A08.C2(GND) A08.T1(GND) A09.C2(GND) A09.T1(GND) A10.C2(GND) A10.T1(GND) A11.C2(GND) A11.T1(GND) A12.C2(GND) A12.T1(GND) A13.C2(GND) A13.T1(GND) A14.C2(GND) A14.T1(GND) A15.C2(GND) A15.T1(GND) A16.C2(GND) A16.T1(GND) A17.C2(GND) A17.T1(GND) A18.C2(GND) A18.T1(GND) A19.C2(GND) A19.T1(GND) A20.C2(GND) A20.T1(GND) AB02.AC2(GND) AB02.BC2(GND) AB03.AD1(GND) AB03.AE1(GND) AB03.AF1(GND) AB03.AH1(GND) AB03.AJ1(GND) AB03.AK1(GND) AB03.AL1(GND) AB03.AM1(GND) AB03.AN1(GND) AB03.AP1(GND) AB03.AR1(GND) AB03.AS1(GND) AB03.AT1(GND) AB03.AU1(GND) AB03.AV1(GND) AB03.BD1(GND) AB03.BE1(GND) AB03.BF1(GND) AB03.BH1(GND) AB03.BJ1(GND) AB03.BK1(GND) AB03.BL1(GND) AB03.BM1(GND) AB03.BN1(GND) AB03.BP1(GND) AB03.BR1(GND) AB03.BS1(GND) AB03.BT1(GND) AB03.BU1(GND) AB03.BV1(GND) B04.C2(GND) B04.T1(GND) B05.C2(GND) B05.T1(GND) B06.C2(GND) B06.T1(GND) B07.C2(GND) B07.T1(GND) B08.C2(GND) B08.T1(GND) B09.C2(GND) B09.T1(GND) B10.C2(GND) B11.C2(GND) B11.T1(GND) B12.C2(GND) B12.T1(GND) B13.C2(GND) B13.T1(GND) B14.C2(GND) B14.T1(GND) B15.C2(GND) B15.T1(GND) B16.C2(GND) B16.T1(GND) B17.C2(GND) B17.T1(GND) B18.C2(GND) B18.T1(GND) B19.C2(GND) B19.T1(GND) B20.C2(GND) B20.T1(GND) B21.C2(GND) B21.T1(GND) C07.C2(GND) C08.C2(GND) C09.C2(GND) C09.T1(GND) C10.C2(GND) C10.T1(GND) C11.C2(GND) C11.T1(GND) C12.C2(GND) C12.T1(GND) C13.C2(GND) C13.T1(GND) C14.C2(GND) C14.T1(GND) C15.C2(GND) C15.T1(GND) C16.C2(GND) C16.T1(GND) C17.C2(GND) C17.T1(GND) C18.C2(GND) C18.T1(GND) C19.C2(GND) C19.T1(GND) C20.C2(GND) C20.T1(GND) C21.C2(GND) C21.T1(GND) C22.C2(GND) C22.T1(GND) C23.C2(GND) C23.T1(GND) C24.C2(GND) C24.T1(GND) D04.C2 D04.F2 D04.J2 D04.L2 D04.N2 D04.R2 D04.U2 D05.C2(GND) D05.T1(GND) D06.C2(GND) D06.T1(GND) D07.C2(GND) D07.T1(GND) D09.C2(GND) D09.T1(GND) D10.C2(GND) D10.T1(GND) D11.C2(GND) D11.T1(GND) D12.C2(GND) D12.T1(GND) D13.C2(GND) D13.T1(GND) D14.C2(GND) D14.T1(GND) D15.C2(GND) D15.T1(GND) D16.C2(GND) D16.T1(GND) D17.C2(GND) D17.T1(GND) D18.C2(GND) D18.T1(GND) D19.C2(GND) D19.T1(GND) D20.C2(GND) D20.T1(GND) D21.C2(GND) D21.T1(GND) D22.C2(GND) D22.T1(GND) D23.C2(GND) D23.T1(GND) D24.C2(GND) D24.T1(GND) E03.C2 E04.C2 E05.C2 E06.C2 E07.C2 E08.C2 E09.C2(GND) E09.T1(GND) E11.C2(GND) E11.T1(GND) E12.C2(GND) E12.T1(GND) E13.C2(GND) E13.T1(GND) E14.C2(GND) E14.T1(GND) E15.C2(GND) E15.T1(GND) E16.C2(GND) E16.T1(GND) E17.C2(GND) E17.T1(GND) E18.C2(GND) E18.T1(GND) E19.C2(GND) E19.T1(GND) E20.C2(GND) E20.T1(GND) E21.C2(GND) E21.T1(GND) E22.C2(GND) E22.T1(GND) E23.C2(GND) E23.T1(GND) E24.C2(GND) E24.T1(GND) E25.C2(GND) E25.T1(GND) E26.C2(GND) E26.T1(GND) E27.C2(GND) E27.T1(GND) E28.C2(GND) E28.T1(GND) E29.C2(GND) E29.T1(GND) E30.C2(GND) E30.T1(GND) E31.C2(GND) E31.T1(GND) E32.C2(GND) E32.T1(GND) E33.C2(GND) E33.T1(GND) EF10.AC2(GND) EF10.BC2(GND) EF34.AC2(GND) EF34.AT1(GND) EF34.BC2(GND) EF34.BT1(GND) EF35.AC2(GND) EF35.AT1(GND) EF35.BC2(GND) EF35.BT1(GND) EF36.AC2(GND) EF36.AT1(GND) EF36.BC2(GND) EF36.BT1(GND) EF37.AC2(GND) EF37.AT1(GND) EF37.BC2(GND) EF37.BT1(GND) EF38.AC2(GND) EF38.AT1(GND) EF38.BC2(GND) EF38.BT1(GND) EF39.AC2(GND) EF39.AT1(GND) EF39.BC2(GND) EF39.BT1(GND) F04.C2 F05.C2 F06.C2 F07.C2 F08.C2(GND) F09.C2(GND) F09.T1(GND) F11.C2(GND) F11.T1(GND) F12.C2(GND) F12.T1(GND) F13.C2(GND) F13.T1(GND) F14.C2(GND) F14.T1(GND) F15.C2(GND) F15.T1(GND) F16.C2(GND) F16.T1(GND) F17.C2(GND) F17.T1(GND) F18.C2(GND) F18.T1(GND) F19.C2(GND) F19.T1(GND) F20.C2(GND) F20.T1(GND) F21.C2(GND) F21.T1(GND) F22.C2(GND) F22.T1(GND) F23.C2(GND) F23.T1(GND) F24.C2(GND) F24.T1(GND) F25.C2(GND) F25.T1(GND) F26.C2(GND) F26.T1(GND) F27.C2(GND) F27.T1(GND) F28.C2(GND) F28.T1(GND) F29.C2(GND) F29.T1(GND) F30.C2(GND) F30.T1(GND) F31.C2(GND) F31.T1(GND) F32.C2(GND) F32.T1(GND) F33.C2(GND) F33.T1(GND) H01.C2 H01.F2 H01.J2 H01.L2 H01.N2 H01.R2 H01.U2 H02.C2 H02.F2 H02.J2 H02.L2 H02.N2 H02.R2 H02.U2 H03.C2 H03.F2 H03.J2 H03.L2 H03.N2 H03.R2 H03.U2 H04.C2 H04.F2 H04.J2 H04.L2 H04.N2 H04.R2 H04.U2 H05.C2 H05.F2 H05.J2 H05.L2 H05.N2 H05.R2 H05.U2 H06.C2 H07.C2(GND) H08.C2(GND) H09.C2(GND) H10.C2(GND) H11.C2(GND) H12.C2(GND) H13.C2(GND) H14.C2(GND) H15.C2(GND) H16.C2(GND) H17.C2(GND) H18.C2(GND) H19.C2(GND) H20.C2(GND) H21.C2 H22.C2 H33.C2 H35.C2 H36.C2 H37.C2 H38.C2 H39.C2 H40.C2 J01.C2 J01.F2 J01.J2 J01.L2 J01.N2 J01.R2 J01.U2 J02.C2 J02.F2 J02.J2 J02.L2 J02.N2 J02.R2 J02.U2 J03.C2 J03.F2 J03.J2 J03.L2 J03.N2 J03.R2 J03.U2 J04.C2 J04.F2 J04.J2 J04.L2 J04.N2 J04.R2 J04.U2 J05.C2 J05.F2 J05.J2 J05.L2 J05.N2 J05.R2 J05.U2 J06.C2 J06.F2 J06.J2 J06.L2 J06.N2 J06.R2 J06.U2 J07.C2 J07.F2 J07.J2 J07.L2 J07.N2 J07.R2 J07.U2 J08.C2 J08.F2 J08.J2 J08.L2 J08.N2 J08.R2 J08.U2 J09.C2 J09.F2 J09.J2 J09.L2 J09.N2 J09.R2 J09.U2 J10.C2 J10.F2 J10.J2 J10.L2 J10.N2 J10.R2 J10.U2 J11.C2 J11.F2 J11.J2 J11.L2 J11.N2 J11.R2 J11.U2 J13.C2(GND) J13.T1(GND) J14.C2(GND) J14.T1(GND) J15.C2(GND) J15.T1(GND) J16.C2(GND) J16.T1(GND) J17.C2(GND) J17.T1(GND) J18.C2(GND) J18.T1(GND) J19.C2(GND) J19.T1(GND) J20.C2(GND) J20.T1(GND) J21.C2 J22.C2 J35.C2 J36.C2 J37.C2 J38.C2 J39.C2 J40.C2
VCC: A04.A2(VCC) A05.A2(VCC) A06.A2(VCC) A07.A2(VCC) A08.A2(VCC) A09.A2(VCC) A10.A2(VCC) A11.A2(VCC) A12.A2(VCC) A13.A2(VCC) A14.A2(VCC) A15.A2(VCC) A16.A2(VCC) A17.A2(VCC) A18.A2(VCC) A19.A2(VCC) A20.A2(VCC) AB02.AA2(VCC) AB02.BA2(VCC) AB03.AD2(VCC) AB03.AE2(VCC) AB03.AF2(VCC) AB03.AH2(VCC) AB03.AJ2(VCC) AB03.AK2(VCC) AB03.AL2(VCC) AB03.AM2(VCC) AB03.AN2(VCC) AB03.AP2(VCC) AB03.AR2(VCC) AB03.AS2(VCC) AB03.AT2(VCC) AB03.AU2(VCC) AB03.AV2(VCC) AB03.BD2(VCC) AB03.BE2(VCC) AB03.BF2(VCC) AB03.BH2(VCC) AB03.BJ2(VCC) B04.A2(VCC) B05.A2(VCC) B06.A2(VCC) B07.A2(VCC) B08.A2(VCC) B09.A2(VCC) B10.A2(VCC) B11.A2(VCC) B12.A2(VCC) B13.A2(VCC) B14.A2(VCC) B15.A2(VCC) B16.A2(VCC) B17.A2(VCC) B18.A2(VCC) B19.A2(VCC) B20.A2(VCC) B21.A2(VCC) C07.A2(VCC) C08.A2(VCC) C09.A2(VCC) C10.A2(VCC) C11.A2(VCC) C12.A2(VCC) C13.A2(VCC) C14.A2(VCC) C15.A2(VCC) C16.A2(VCC) C17.A2(VCC) C18.A2(VCC) C19.A2(VCC) C20.A2(VCC) C21.A2(VCC) C22.A2(VCC) C23.A2(VCC) C24.A2(VCC) D05.A2(VCC) D06.A2(VCC) D07.A2(VCC) D09.A2(VCC) D10.A2(VCC) D11.A2(VCC) D12.A2(VCC) D13.A2(VCC) D14.A2(VCC) D15.A2(VCC) D16.A2(VCC) D17.A2(VCC) D18.A2(VCC) D19.A2(VCC) D20.A2(VCC) D21.A2(VCC) D22.A2(VCC) D23.A2(VCC) D24.A2(VCC) E03.A2 E04.A2 E05.A2 E06.A2 E07.A2 E08.A2 E09.A2(VCC) E11.A2(VCC) E12.A2(VCC) E13.A2(VCC) E14.A2(VCC) E15.A2(VCC) E16.A2(VCC) E17.A2(VCC) E18.A2(VCC) E19.A2(VCC) E20.A2(VCC) E21.A2(VCC) E22.A2(VCC) E23.A2(VCC) E24.A2(VCC) E25.A2(VCC) E26.A2(VCC) E27.A2(VCC) E28.A2(VCC) E29.A2(VCC) E30.A2(VCC) E31.A2(VCC) E32.A2(VCC) E33.A2(VCC) EF10.AA2(VCC) EF10.BA2(VCC) EF34.AA2(VCC) EF34.BA2(VCC) EF35.AA2(VCC) EF35.BA2(VCC) EF36.AA2(VCC) EF36.BA2(VCC) EF37.AA2(VCC) EF37.BA2(VCC) EF38.AA2(VCC) EF38.BA2(VCC) EF39.AA2(VCC) EF39.BA2(VCC) F04.A2 F05.A2 F06.A2 F07.A2 F08.A2(VCC) F09.A2(VCC) F11.A2(VCC) F12.A2(VCC) F13.A2(VCC) F14.A2(VCC) F15.A2(VCC) F16.A2(VCC) F17.A2(VCC) F18.A2(VCC) F19.A2(VCC) F20.A2(VCC) F21.A2(VCC) F22.A2(VCC) F23.A2(VCC) F24.A2(VCC) F25.A2(VCC) F26.A2(VCC) F27.A2(VCC) F28.A2(VCC) F29.A2(VCC) F30.A2(VCC) F31.A2(VCC) F32.A2(VCC) F33.A2(VCC) H06.A2 H07.A2(VCC) H08.A2(VCC) H09.A2(VCC) H10.A2(VCC) H11.A2(VCC) H12.A2(VCC) H13.A2(VCC) H14.A2(VCC) H15.A2(VCC) H16.A2(VCC) H17.A2(VCC) H18.A2(VCC) H19.A2(VCC) H20.A2(VCC) H21.A2 H22.A2 H33.A2 H35.A2 H36.A2 H37.A2 H38.A2 H39.A2 H40.A2 J13.A2(VCC) J14.A2(VCC) J15.A2(VCC) J16.A2(VCC) J17.A2(VCC) J18.A2(VCC) J19.A2(VCC) J20.A2(VCC) J21.A2 J22.A2 J35.A2 J36.A2 J37.A2 J38.A2 J39.A2 J40.A2

## Library data of the parts
A04 = dec-m:M703: M703 Power Fail and Restart
A05 A06 A11-A19 B06 B08 B09 B21 C09 C10 C14-C18 D07 D12-D16 E09 E11 E12 E15 E22 E24 F20-F22 F25 F29 F32 = dec-m:M113: 10 2-input NAND Gates
A07-A09 A10 = dec-m:M162: Parity Circuit
A20 B04 B07 B20 C11 C19-C21 D09 D17-D19 E14 E21 E25 F26 F28 = dec-m:M115: 8 3-input NAND Gates
A40 B40 C40 D40 E40 F40 = dec-m:M916: Simple 36 pin connector/wire cable
AB02 = dec-m:G826: Regulator and Power Detector
AB03 = dec-m:G792: Power Supply Connector
B05 B11 B17-B19 C22-C24 D11 D24 = dec-m:M216: Two sets of 3 D flip-flops
B10 = dec-m:M720: M720 Memory Detection
B12-B16 C12 D22 E31 E32 F30 F31 = dec-m:M617: 6 4-input NAND Buffers
C07 = dec-m:M661: Positive Level Driver
C08 F08 = dec-m:M660: Positive Level Driver
C13 D06 E16 E17 F12-F18 = dec-m:M310: Tapped Delay Line
D04 H01-H05 J01-J09 J10 J11 = dec-m:W011: One-sided 9 pin connector/cable with grounds (Negibus).
D05 = dec-m:M516: Hex Positive Bus Receiver
D10 D20 D21 F11 F19 F23 F24 F27 = dec-m:M117: 6 4-input NAND Gates
D23 E13 E26-E30 F33 = dec-m:M160: AND-NOR Gates
E03-E08 F04-F07 H06 H21 H22 H33 H35-H40 J21 J22 J35-J40 = dec-m:EMPTY: Empty Slot
E18-E20 E23 E33 = dec-m:M206X: Two sets of 3 D flip-flops
EF10 = dec-m:M700: Manual Function Timing and Run
EF34-EF39 = dec-m:M220: PDP-8 Major Registers
F09 = dec-m:M119: 3 8-input NAND Gates
H07-H09 H10-H20 = dec-m:M650
J13-J20 = dec-m:M506: Hex Negative Bus Receiver

## Net classes
1 Suppply: width 1.016 mm